# EAGLE schematic artemis_board (EAGLE 9.5.1)

## Sheet 1 of 6
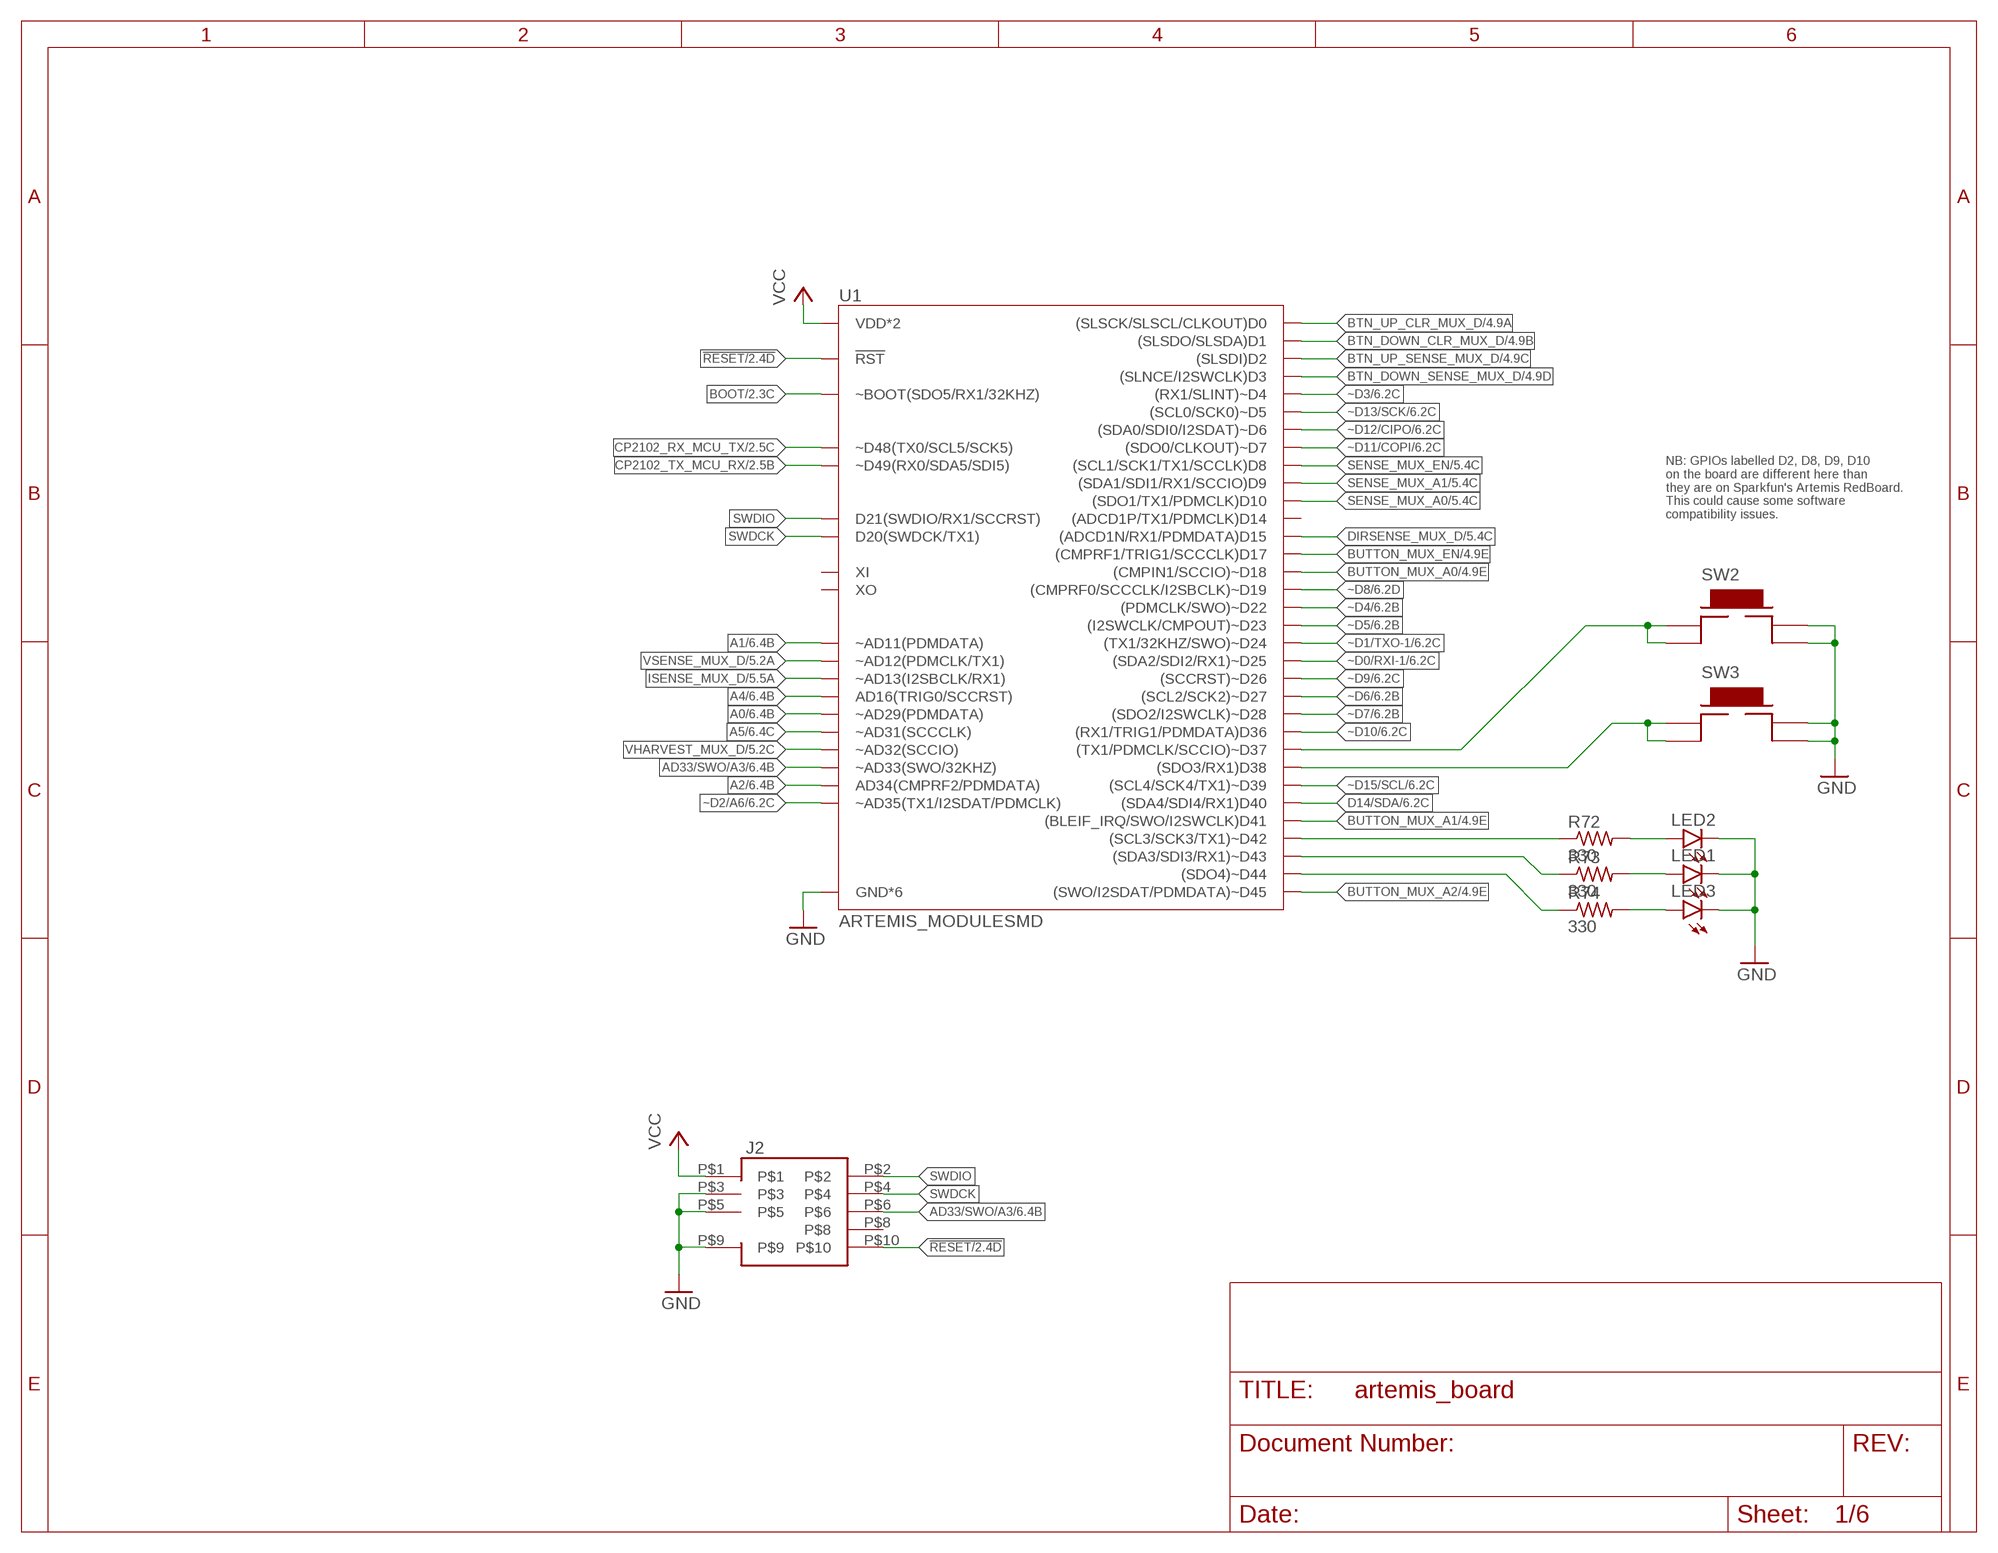
[diagram p0: schematic, sheet 1]

### Parts
J2  FTSH-105-01-F-DV-007-K-P  [FTSH-105-01-F-DV-007-K-P]
LED1  LEDCHIP-LED0603  [CHIP-LED0603]
LED2  LEDCHIP-LED0603  [CHIP-LED0603]
LED3  LEDCHIP-LED0603  [CHIP-LED0603]
R72  330  R-US_R0402  [R0402]
R73  330  R-US_R0402  [R0402]
R74  330  R-US_R0402  [R0402]
SW2  TE_FSM4JSMA  [TE_FSMJSMA]
SW3  TE_FSM4JSMA  [TE_FSMJSMA]
U1  ARTEMIS_MODULESMD  [ARTEMIS_FP]

### Nets
!RESET: J2.P$10 U1.~RST(!RST) ; also sheet 2,6
A0: U1.~AD29(~AD29(PDMDATA)) ; also sheet 6
A1: U1.~AD11(~AD11(PDMDATA)) ; also sheet 6
A2: U1.AD34(AD34(CMPRF2/PDMDATA)) ; also sheet 6
A4: U1.AD16(AD16(TRIG0/SCCRST)) ; also sheet 6
A5: U1.~AD31(~AD31(SCCCLK)) ; also sheet 6
AD33/SWO/A3: J2.P$6 U1.~AD33/SWO(~AD33(SWO/32KHZ)) ; also sheet 6
BOOT: U1.BOOT(~BOOT(SDO5/RX1/32KHZ)) ; also sheet 2
BTN_DOWN_CLR_MUX_D: U1.D1((SLSDO/SLSDA)D1) ; also sheet 4
BTN_DOWN_SENSE_MUX_D: U1.D3((SLNCE/I2SWCLK)D3) ; also sheet 4
BTN_UP_CLR_MUX_D: U1.D0((SLSCK/SLSCL/CLKOUT)D0) ; also sheet 4
BTN_UP_SENSE_MUX_D: U1.D2((SLSDI)D2) ; also sheet 4
BUTTON_MUX_A0: U1.~D18((CMPIN1/SCCIO)~D18) ; also sheet 4
BUTTON_MUX_A1: U1.D41((BLEIF_IRQ/SWO/I2SWCLK)D41) ; also sheet 4
BUTTON_MUX_A2: U1.~D45((SWO/I2SDAT/PDMDATA)~D45) ; also sheet 4
BUTTON_MUX_EN: U1.D17((CMPRF1/TRIG1/SCCCLK)D17) ; also sheet 4
CP2102_RX_MCU_TX: U1.TXO-0(~D48(TX0/SCL5/SCK5)) ; also sheet 2
CP2102_TX_MCU_RX: U1.RXI-0(~D49(RX0/SDA5/SDI5)) ; also sheet 2
D14/SDA: U1.D40((SDA4/SDI4/RX1)D40) ; also sheet 6
DIRSENSE_MUX_D: U1.D15((ADCD1N/RX1/PDMDATA)D15) ; also sheet 5
GND: J2.P$3 J2.P$5 J2.P$9 LED1.C LED2.C LED3.C SW2.P$3 SW2.P$4 SW3.P$3 SW3.P$4 U1.GND@1(GND*6) U1.GND@22(GND*6) U1.GND@38(GND*6) U1.GND@39(GND*6) U1.GND@47(GND*6) U1.GND@59(GND*6) ; also sheet 2,3,4,5,6
ISENSE_MUX_D: U1.~AD13(~AD13(I2SBCLK/RX1)) ; also sheet 5
N$1: R72.1 U1.~D42((SCL3/SCK3/TX1)~D42)
N$5: R73.1 U1.~D43((SDA3/SDI3/RX1)~D43)
N$29: R74.1 U1.~D44((SDO4)~D44)
N$30: LED2.A R72.2
N$31: LED1.A R73.2
N$38: LED3.A R74.2
N$43: SW2.P$1 SW2.P$2 U1.~D37((TX1/PDMCLK/SCCIO)~D37)
N$45: SW3.P$1 SW3.P$2 U1.D38((SDO3/RX1)D38)
SENSE_MUX_A0: U1.D10((SDO1/TX1/PDMCLK)D10) ; also sheet 5
SENSE_MUX_A1: U1.D9((SDA1/SDI1/RX1/SCCIO)D9) ; also sheet 5
SENSE_MUX_EN: U1.D8((SCL1/SCK1/TX1/SCCLK)D8) ; also sheet 5
SWDCK: J2.P$4 U1.SWDCK(D20(SWDCK/TX1))
SWDIO: J2.P$2 U1.SWDIO(D21(SWDIO/RX1/SCCRST))
VCC: J2.P$1 U1.VDD@36(VDD*2) U1.VDD@37(VDD*2) ; also sheet 2,4,5,6
VHARVEST_MUX_D: U1.~AD32(~AD32(SCCIO)) ; also sheet 5
VSENSE_MUX_D: U1.~AD12(~AD12(PDMCLK/TX1)) ; also sheet 5
~D0/RXI-1: U1.~D25((SDA2/SDI2/RX1)~D25) ; also sheet 6
~D1/TXO-1: U1.~D24((TX1/32KHZ/SWO)~D24) ; also sheet 6
~D2/A6: U1.~AD35(~AD35(TX1/I2SDAT/PDMCLK)) ; also sheet 6
~D3: U1.~D4((RX1/SLINT)~D4) ; also sheet 6
~D4: U1.~D22((PDMCLK/SWO)~D22) ; also sheet 6
~D5: U1.~D23((I2SWCLK/CMPOUT)~D23) ; also sheet 6
~D6: U1.~D27((SCL2/SCK2)~D27) ; also sheet 6
~D7: U1.~D28((SDO2/I2SWCLK)~D28) ; also sheet 6
~D8: U1.~D19((CMPRF0/SCCCLK/I2SBCLK)~D19) ; also sheet 6
~D9: U1.~D26((SCCRST)~D26) ; also sheet 6
~D10: U1.D36((RX1/TRIG1/PDMDATA)D36) ; also sheet 6
~D11/COPI: U1.D7((SDO0/CLKOUT)~D7) ; also sheet 6
~D12/CIPO: U1.~D6((SDA0/SDI0/I2SDAT)~D6) ; also sheet 6
~D13/SCK: U1.~D5((SCL0/SCK0)~D5) ; also sheet 6
~D15/SCL: U1.~D39((SCL4/SCK4/TX1)~D39) ; also sheet 6
Unconnected: J2.P$8 U1.D14((ADCD1P/TX1/PDMCLK)D14) U1.XI U1.XO

### Notes on the sheet
- NB: GPIOs labelled D2, D8, D9, D10
  on the board are different here than
  they are on Sparkfun's Artemis RedBoard.
  This could cause some software 
  compatibility issues.

## Sheet 2 of 6
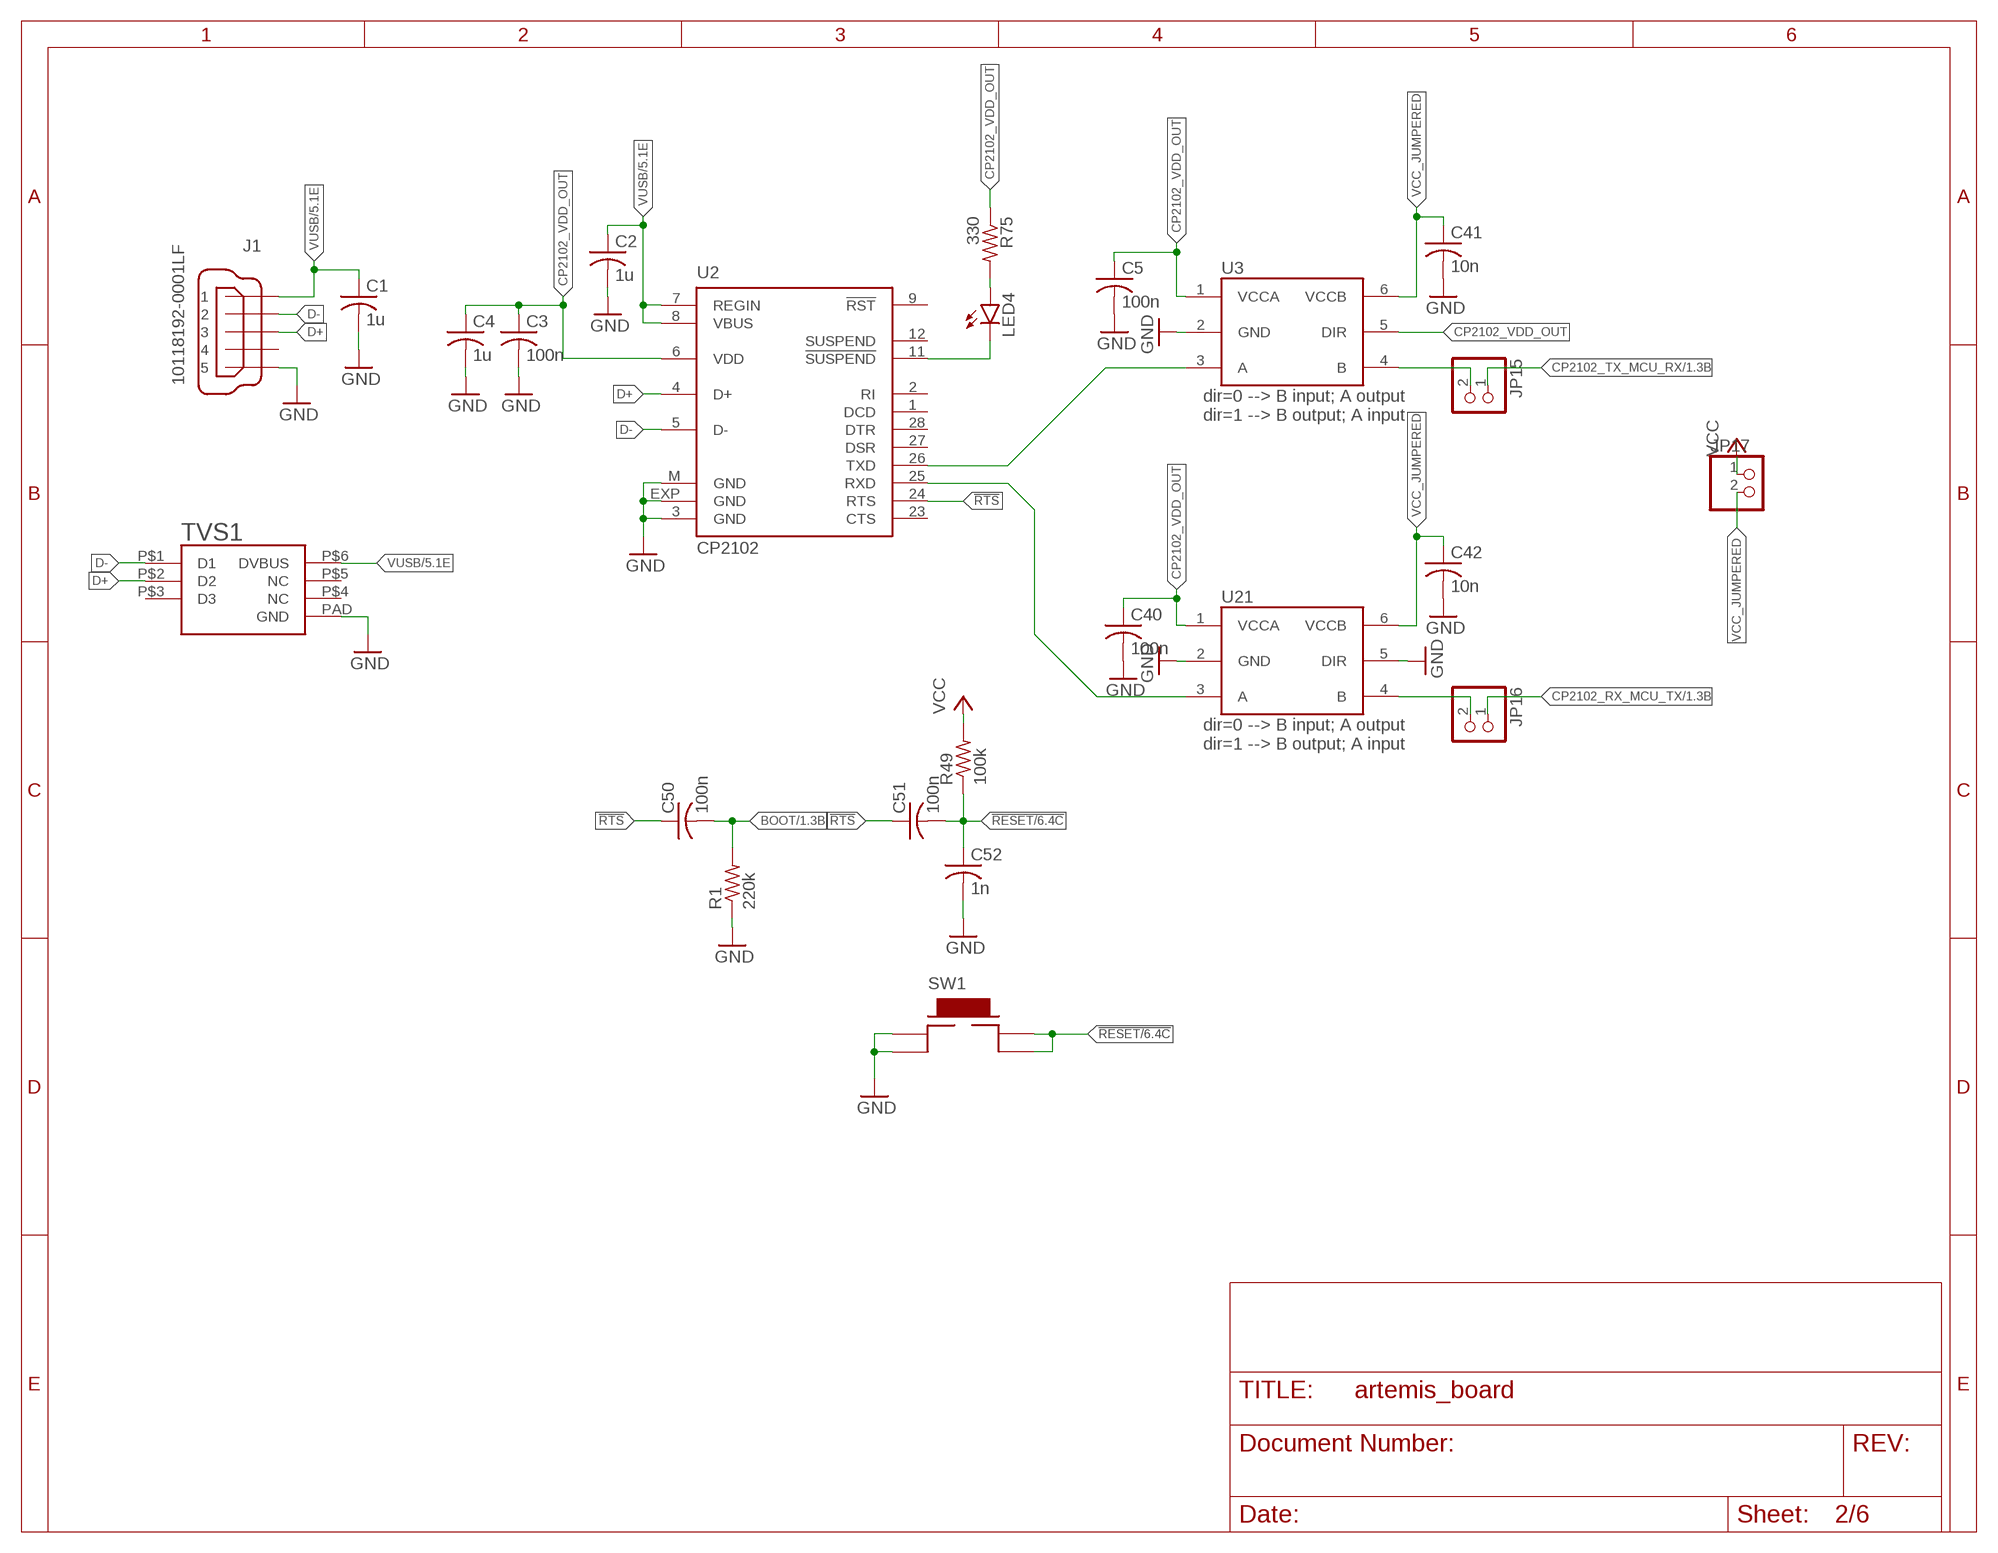
[diagram p1: schematic, sheet 2]

### Parts
C1  1u  C-USC0402  [C0402]
C2  1u  C-USC0402  [C0402]
C3  100n  C-USC0402  [C0402]
C4  1u  C-USC0402  [C0402]
C5  100n  C-USC0402  [C0402]
C40  100n  C-USC0402  [C0402]
C41  10n  C-USC0402  [C0402]
C42  10n  C-USC0402  [C0402]
C50  100n  C-USC0402  [C0402]
C51  100n  C-USC0402  [C0402]
C52  1n  C-USC0402  [C0402]
J1  10118192-0001LF  [10118192-0001LF]
JP15  PINHD-1X2  [1X02]
JP16  PINHD-1X2  [1X02]
JP17  PINHD-1X2  [1X02]
LED4  LEDCHIP-LED0603  [CHIP-LED0603]
R1  220k  R-US_R0402  [R0402]
R49  100k  R-US_R0402  [R0402]
R75  330  R-US_R0402  [R0402]
SW1  TE_FSM4JSMA  [TE_FSMJSMA]
TVS1  RCLAMP3654PAT  [RCLAMP3654PATCT]
U2  CP2102  [MLP28]
U3  74AXP1T45GWH  [SOT65P210X110-6N]
U21  74AXP1T45GWH  [SOT65P210X110-6N]

### Nets
!RESET: C51.2 C52.1 R49.1 SW1.P$3 SW1.P$4 ; also sheet 1,6
!RTS: C50.1 C51.1 U2.24(RTS)
BOOT: C50.2 R1.2 ; also sheet 1
CP2102_RX_MCU_TX: JP16.1 ; also sheet 1
CP2102_TX_MCU_RX: JP15.1 ; also sheet 1
CP2102_VDD_OUT: C3.1 C4.1 C5.1 C40.1 R75.1 U2.6(VDD) U3.1(VCCA) U3.5(DIR) U21.1(VCCA)
D+: J1.3 TVS1.P$2(D2) U2.4(D+)
D-: J1.2 TVS1.P$1(D1) U2.5(D-)
GND: C1.2 C2.2 C3.2 C4.2 C5.2 C40.2 C41.2 C42.2 C52.2 J1.5 R1.1 SW1.P$1 SW1.P$2 TVS1.PAD(GND) U2.3(GND) U2.EXP(GND) U2.M(GND) U3.2(GND) U21.2(GND) U21.5(DIR) ; also sheet 1,3,4,5,6
N$3: LED4.A R75.2
N$26: JP15.2 U3.4(B)
N$27: JP16.2 U21.4(B)
N$28: LED4.C U2.11(!SUSPEND)
RXD_3V3: U2.25(RXD) U21.3(A)
TXD_3V3: U2.26(TXD) U3.3(A)
VCC: JP17.1 R49.2 ; also sheet 1,4,5,6
VCC_JUMPERED: C41.1 C42.1 JP17.2 U3.6(VCCB) U21.6(VCCB)
VUSB: C1.1 C2.1 J1.1 TVS1.P$6(DVBUS) U2.7(REGIN) U2.8(VBUS) ; also sheet 5
Unconnected: J1.4 TVS1.P$3(D3) TVS1.P$4(NC) TVS1.P$5(NC) U2.1(DCD) U2.2(RI) U2.9(!RST) U2.12(SUSPEND) U2.23(CTS) U2.27(DSR) U2.28(DTR)

## Sheet 3 of 6
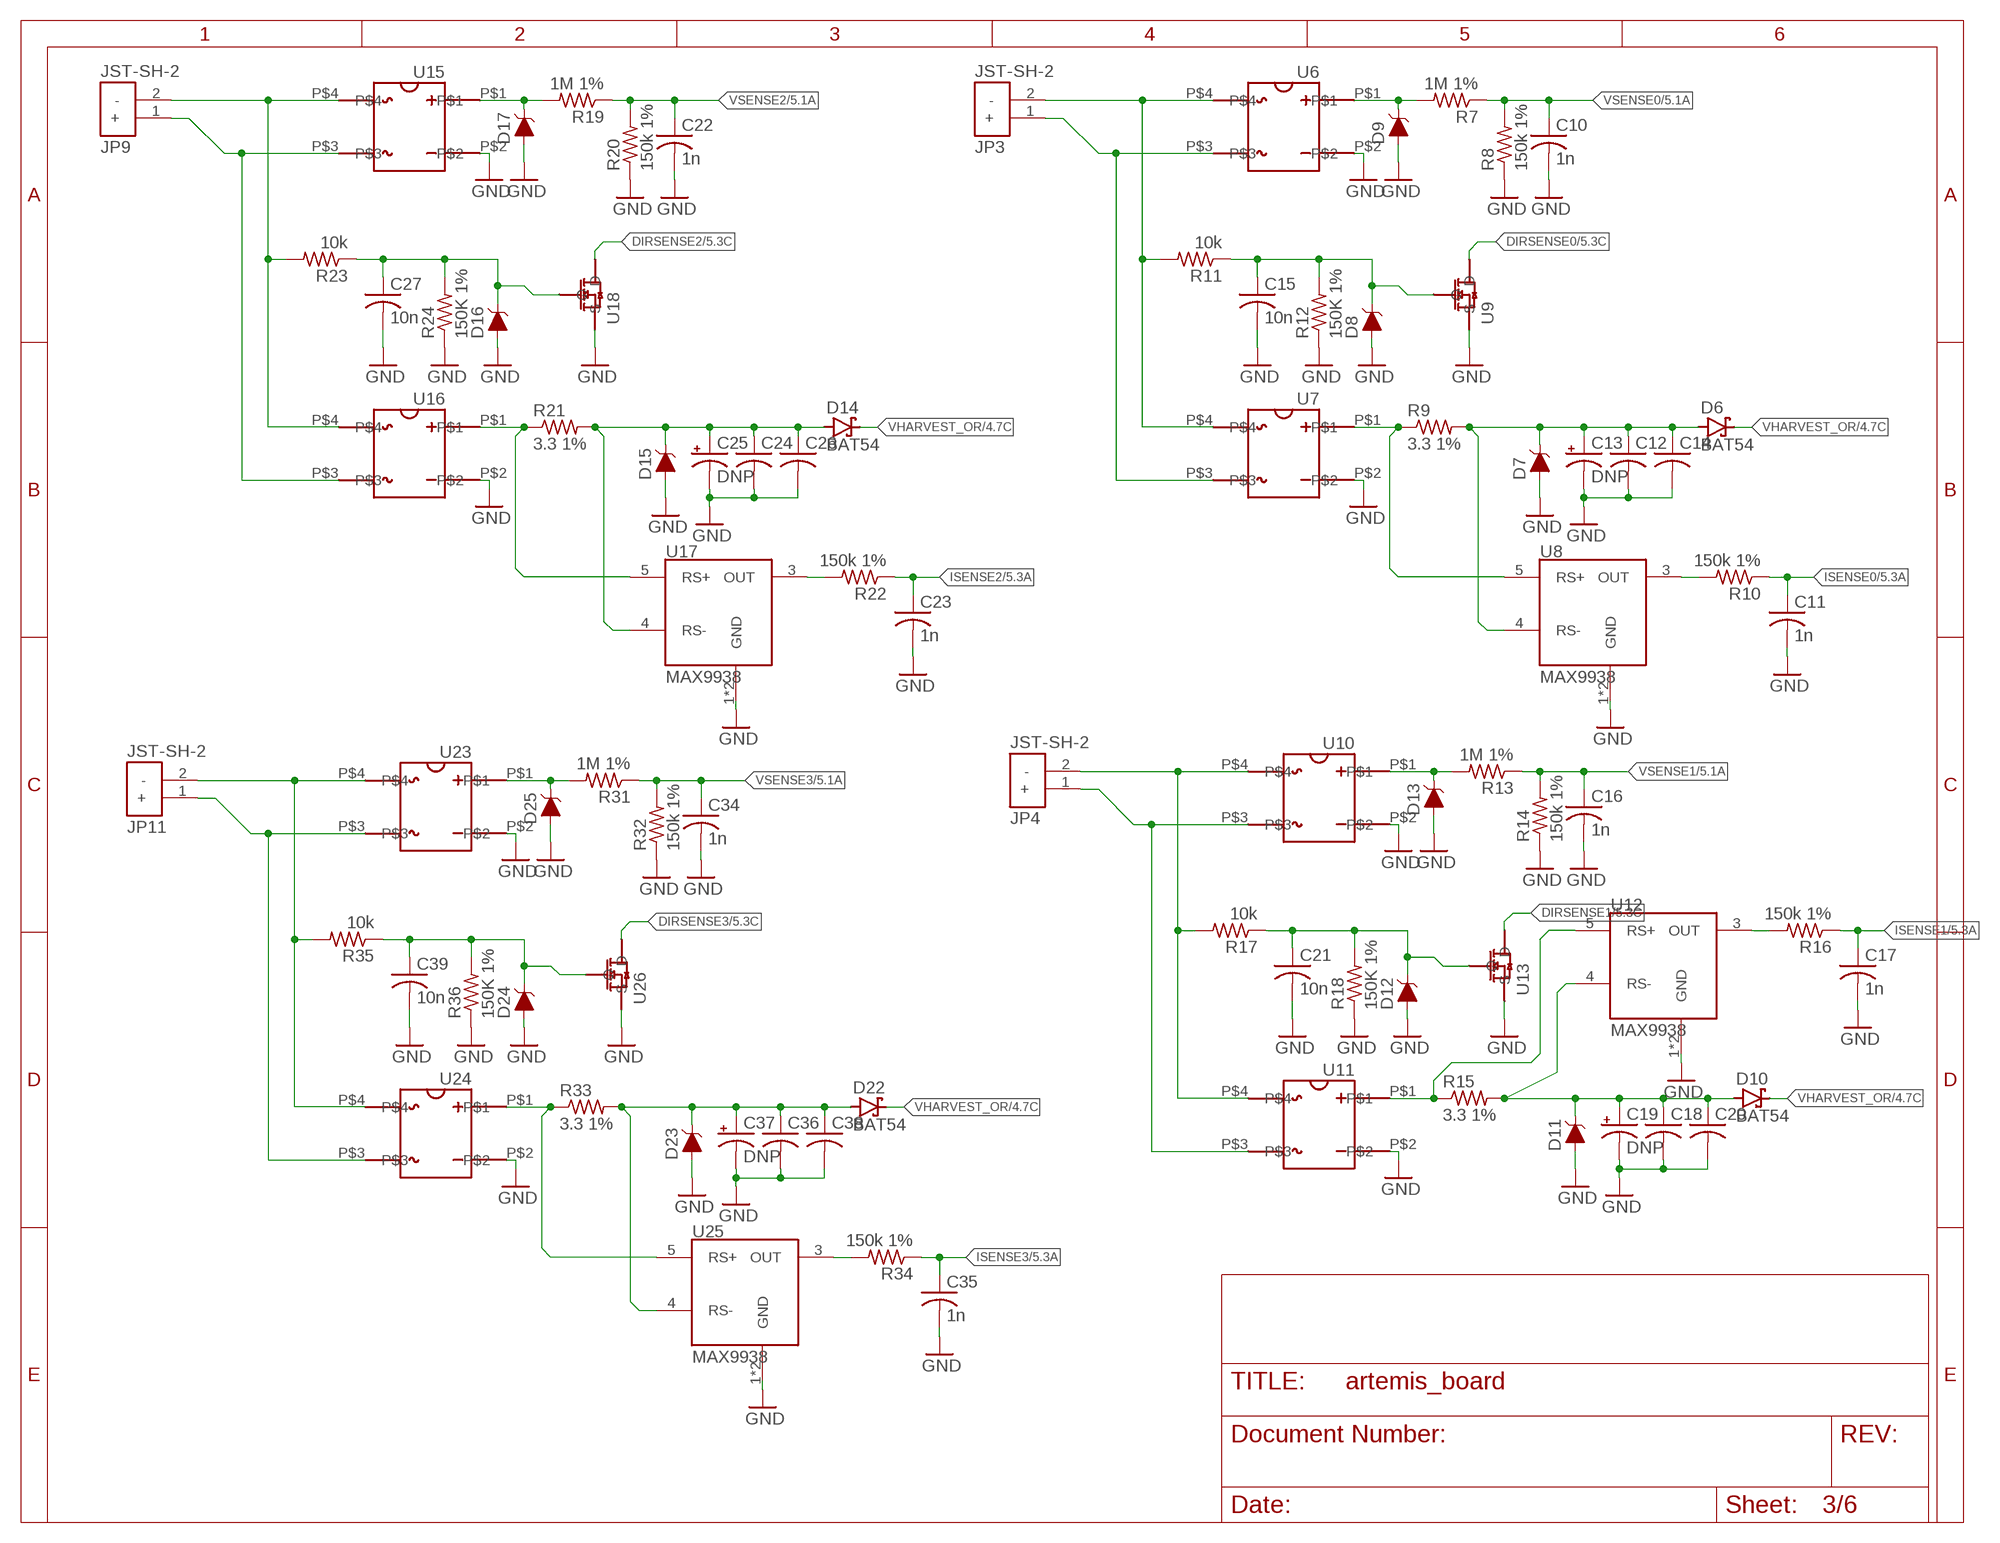
[diagram p2: schematic, sheet 3]

### Parts
C10  1n  C-USC0402  [C0402]
C11  1n  C-USC0402  [C0402]
C12  C-USC1206  [C1206]
C13  DNP  CPOL-USE2.5-5  [E2,5-5]
C14  C-USC1206  [C1206]
C15  10n  C-USC0402  [C0402]
C16  1n  C-USC0402  [C0402]
C17  1n  C-USC0402  [C0402]
C18  C-USC1206  [C1206]
C19  DNP  CPOL-USE2.5-5  [E2,5-5]
C20  C-USC1206  [C1206]
C21  10n  C-USC0402  [C0402]
C22  1n  C-USC0402  [C0402]
C23  1n  C-USC0402  [C0402]
C24  C-USC1206  [C1206]
C25  DNP  CPOL-USE2.5-5  [E2,5-5]
C26  C-USC1206  [C1206]
C27  10n  C-USC0402  [C0402]
C34  1n  C-USC0402  [C0402]
C35  1n  C-USC0402  [C0402]
C36  C-USC1206  [C1206]
C37  DNP  CPOL-USE2.5-5  [E2,5-5]
C38  C-USC1206  [C1206]
C39  10n  C-USC0402  [C0402]
D6  BAT54  [SOT23]
D7  3.3V  DIODE-ZENER-MM3Z3V3T1G  [SOD-323]
D8  3.3V  DIODE-ZENER-MM3Z3V3T1G  [SOD-323]
D9  3.3V  DIODE-ZENER-MM3Z3V3T1G  [SOD-323]
D10  BAT54  [SOT23]
D11  3.3V  DIODE-ZENER-MM3Z3V3T1G  [SOD-323]
D12  3.3V  DIODE-ZENER-MM3Z3V3T1G  [SOD-323]
D13  3.3V  DIODE-ZENER-MM3Z3V3T1G  [SOD-323]
D14  BAT54  [SOT23]
D15  3.3V  DIODE-ZENER-MM3Z3V3T1G  [SOD-323]
D16  3.3V  DIODE-ZENER-MM3Z3V3T1G  [SOD-323]
D17  3.3V  DIODE-ZENER-MM3Z3V3T1G  [SOD-323]
D22  BAT54  [SOT23]
D23  3.3V  DIODE-ZENER-MM3Z3V3T1G  [SOD-323]
D24  3.3V  DIODE-ZENER-MM3Z3V3T1G  [SOD-323]
D25  3.3V  DIODE-ZENER-MM3Z3V3T1G  [SOD-323]
JP3  JST-SH-2  [JST-SH-2]
JP4  JST-SH-2  [JST-SH-2]
JP9  JST-SH-2  [JST-SH-2]
JP11  JST-SH-2  [JST-SH-2]
R7  1M 1%  R-US_R0402  [R0402]
R8  150k 1%  R-US_R0402  [R0402]
R9  3.3 1%  R-US_R0603  [R0603]
R10  150k 1%  R-US_R0402  [R0402]
R11  10k  R-US_R0402  [R0402]
R12  150K 1%  R-US_R0402  [R0402]
R13  1M 1%  R-US_R0402  [R0402]
R14  150k 1%  R-US_R0402  [R0402]
R15  3.3 1%  R-US_R0603  [R0603]
R16  150k 1%  R-US_R0402  [R0402]
R17  10k  R-US_R0402  [R0402]
R18  150K 1%  R-US_R0402  [R0402]
R19  1M 1%  R-US_R0402  [R0402]
R20  150k 1%  R-US_R0402  [R0402]
R21  3.3 1%  R-US_R0603  [R0603]
R22  150k 1%  R-US_R0402  [R0402]
R23  10k  R-US_R0402  [R0402]
R24  150K 1%  R-US_R0402  [R0402]
R31  1M 1%  R-US_R0402  [R0402]
R32  150k 1%  R-US_R0402  [R0402]
R33  3.3 1%  R-US_R0603  [R0603]
R34  150k 1%  R-US_R0402  [R0402]
R35  10k  R-US_R0402  [R0402]
R36  150K 1%  R-US_R0402  [R0402]
U6  CDBHD140L-G  [CDBHDXX0L-G]
U7  CDBHD140L-G  [CDBHDXX0L-G]
U8  MAX9938  [SOT23-5]
U9  TN2106K1-G  [TN2106K1-G]
U10  CDBHD140L-G  [CDBHDXX0L-G]
U11  CDBHD140L-G  [CDBHDXX0L-G]
U12  MAX9938  [SOT23-5]
U13  TN2106K1-G  [TN2106K1-G]
U15  CDBHD140L-G  [CDBHDXX0L-G]
U16  CDBHD140L-G  [CDBHDXX0L-G]
U17  MAX9938  [SOT23-5]
U18  TN2106K1-G  [TN2106K1-G]
U23  CDBHD140L-G  [CDBHDXX0L-G]
U24  CDBHD140L-G  [CDBHDXX0L-G]
U25  MAX9938  [SOT23-5]
U26  TN2106K1-G  [TN2106K1-G]

### Nets
DIRSENSE0: U9.D ; also sheet 5
DIRSENSE1: U13.D ; also sheet 5
DIRSENSE2: U18.D ; also sheet 5
DIRSENSE3: U26.D ; also sheet 5
GND: C10.2 C11.2 C12.2 C13.- C14.2 C15.2 C16.2 C17.2 C18.2 C19.- C20.2 C21.2 C22.2 C23.2 C24.2 C25.- C26.2 C27.2 C34.2 C35.2 C36.2 C37.- C38.2 C39.2 D7.A D8.A D9.A D11.A D12.A D13.A D15.A D16.A D17.A D23.A D24.A D25.A R8.1 R12.1 R14.1 R18.1 R20.1 R24.1 R32.1 R36.1 U6.P$2 U7.P$2 U8.1(GND) U8.2(GND) U9.S U10.P$2 U11.P$2 U12.1(GND) U12.2(GND) U13.S U15.P$2 U16.P$2 U17.1(GND) U17.2(GND) U18.S U23.P$2 U24.P$2 U25.1(GND) U25.2(GND) U26.S ; also sheet 1,2,4,5,6
ISENSE0: C11.1 R10.1 ; also sheet 5
ISENSE1: C17.1 R16.1 ; also sheet 5
ISENSE2: C23.1 R22.1 ; also sheet 5
ISENSE3: C35.1 R34.1 ; also sheet 5
N$8: JP3.2(-) R11.2 U6.P$4 U7.P$4
N$9: JP3.1(+) U6.P$3 U7.P$3
N$10: D9.C R7.2 U6.P$1
N$11: R9.1 U7.P$1 U8.5(RS+)
N$12: R10.2 U8.3(OUT)
N$13: C15.1 D8.C R11.1 R12.2 U9.G
N$14: JP4.2(-) R17.2 U10.P$4 U11.P$4
N$15: JP4.1(+) U10.P$3 U11.P$3
N$16: D13.C R13.2 U10.P$1
N$17: R15.1 U11.P$1 U12.5(RS+)
N$18: R16.2 U12.3(OUT)
N$19: C21.1 D12.C R17.1 R18.2 U13.G
N$20: JP9.2(-) R23.2 U15.P$4 U16.P$4
N$21: JP9.1(+) U15.P$3 U16.P$3
N$22: D17.C R19.2 U15.P$1
N$23: R21.1 U16.P$1 U17.5(RS+)
N$24: R22.2 U17.3(OUT)
N$25: C27.1 D16.C R23.1 R24.2 U18.G
N$32: JP11.2(-) R35.2 U23.P$4 U24.P$4
N$33: JP11.1(+) U23.P$3 U24.P$3
N$34: D25.C R31.2 U23.P$1
N$35: R33.1 U24.P$1 U25.5(RS+)
N$36: R34.2 U25.3(OUT)
N$37: C39.1 D24.C R35.1 R36.2 U26.G
VHARVEST0: C12.1 C13.+ C14.1 D6.1(A) D7.C R9.2 U8.4(RS-) ; also sheet 5
VHARVEST1: C18.1 C19.+ C20.1 D10.1(A) D11.C R15.2 U12.4(RS-) ; also sheet 5
VHARVEST2: C24.1 C25.+ C26.1 D14.1(A) D15.C R21.2 U17.4(RS-) ; also sheet 5
VHARVEST3: C36.1 C37.+ C38.1 D22.1(A) D23.C R33.2 U25.4(RS-) ; also sheet 5
VHARVEST_OR: D6.3(C) D10.3(C) D14.3(C) D22.3(C) ; also sheet 4,5,6
VSENSE0: C10.1 R7.1 R8.2 ; also sheet 5
VSENSE1: C16.1 R13.1 R14.2 ; also sheet 5
VSENSE2: C22.1 R19.1 R20.2 ; also sheet 5
VSENSE3: C34.1 R31.1 R32.2 ; also sheet 5

## Sheet 4 of 6
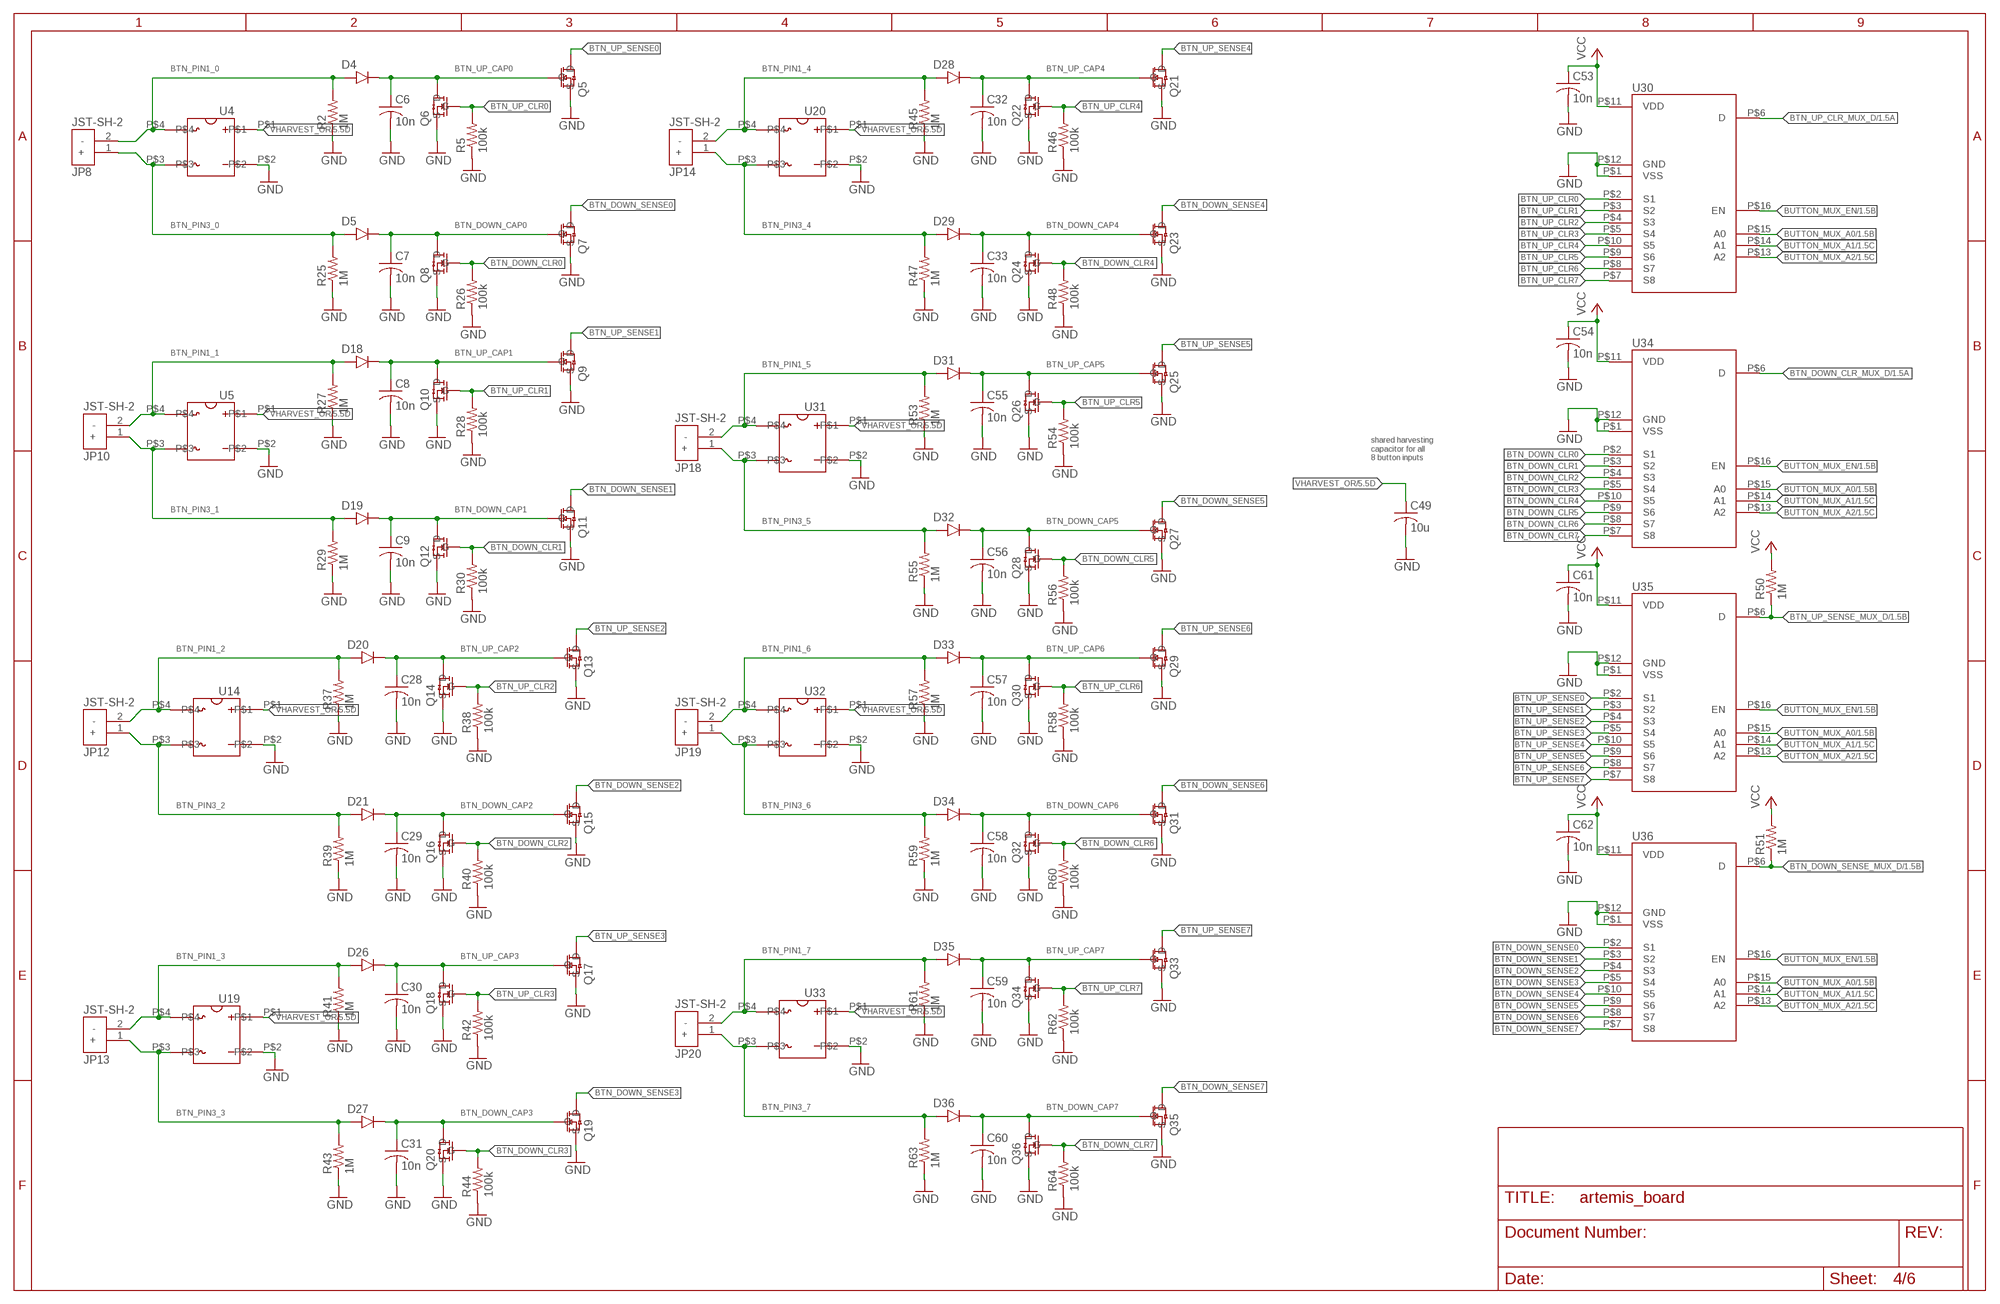
[diagram p3: schematic, sheet 4]

### Parts
C6  10n  C-USC0402  [C0402]
C7  10n  C-USC0402  [C0402]
C8  10n  C-USC0402  [C0402]
C9  10n  C-USC0402  [C0402]
C28  10n  C-USC0402  [C0402]
C29  10n  C-USC0402  [C0402]
C30  10n  C-USC0402  [C0402]
C31  10n  C-USC0402  [C0402]
C32  10n  C-USC0402  [C0402]
C33  10n  C-USC0402  [C0402]
C49  10u  C-USC0603  [C0603]
C53  10n  C-USC0402  [C0402]
C54  10n  C-USC0402  [C0402]
C55  10n  C-USC0402  [C0402]
C56  10n  C-USC0402  [C0402]
C57  10n  C-USC0402  [C0402]
C58  10n  C-USC0402  [C0402]
C59  10n  C-USC0402  [C0402]
C60  10n  C-USC0402  [C0402]
C61  10n  C-USC0402  [C0402]
C62  10n  C-USC0402  [C0402]
D4  DFLU1200  [DFLU1200]
D5  DFLU1200  [DFLU1200]
D18  DFLU1200  [DFLU1200]
D19  DFLU1200  [DFLU1200]
D20  DFLU1200  [DFLU1200]
D21  DFLU1200  [DFLU1200]
D26  DFLU1200  [DFLU1200]
D27  DFLU1200  [DFLU1200]
D28  DFLU1200  [DFLU1200]
D29  DFLU1200  [DFLU1200]
D31  DFLU1200  [DFLU1200]
D32  DFLU1200  [DFLU1200]
D33  DFLU1200  [DFLU1200]
D34  DFLU1200  [DFLU1200]
D35  DFLU1200  [DFLU1200]
D36  DFLU1200  [DFLU1200]
JP8  JST-SH-2  [JST-SH-2]
JP10  JST-SH-2  [JST-SH-2]
JP12  JST-SH-2  [JST-SH-2]
JP13  JST-SH-2  [JST-SH-2]
JP14  JST-SH-2  [JST-SH-2]
JP18  JST-SH-2  [JST-SH-2]
JP19  JST-SH-2  [JST-SH-2]
JP20  JST-SH-2  [JST-SH-2]
Q5  2N7002K-7  [2N7002K-7]
Q6  BSS138K  [BSS138K]
Q7  2N7002K-7  [2N7002K-7]
Q8  BSS138K  [BSS138K]
Q9  2N7002K-7  [2N7002K-7]
Q10  BSS138K  [BSS138K]
Q11  2N7002K-7  [2N7002K-7]
Q12  BSS138K  [BSS138K]
Q13  2N7002K-7  [2N7002K-7]
Q14  BSS138K  [BSS138K]
Q15  2N7002K-7  [2N7002K-7]
Q16  BSS138K  [BSS138K]
Q17  2N7002K-7  [2N7002K-7]
Q18  BSS138K  [BSS138K]
Q19  2N7002K-7  [2N7002K-7]
Q20  BSS138K  [BSS138K]
Q21  2N7002K-7  [2N7002K-7]
Q22  BSS138K  [BSS138K]
Q23  2N7002K-7  [2N7002K-7]
Q24  BSS138K  [BSS138K]
Q25  2N7002K-7  [2N7002K-7]
Q26  BSS138K  [BSS138K]
Q27  2N7002K-7  [2N7002K-7]
Q28  BSS138K  [BSS138K]
Q29  2N7002K-7  [2N7002K-7]
Q30  BSS138K  [BSS138K]
Q31  2N7002K-7  [2N7002K-7]
Q32  BSS138K  [BSS138K]
Q33  2N7002K-7  [2N7002K-7]
Q34  BSS138K  [BSS138K]
Q35  2N7002K-7  [2N7002K-7]
Q36  BSS138K  [BSS138K]
R2  1M  R-US_R0402  [R0402]
R5  100k  R-US_R0402  [R0402]
R25  1M  R-US_R0402  [R0402]
R26  100k  R-US_R0402  [R0402]
R27  1M  R-US_R0402  [R0402]
R28  100k  R-US_R0402  [R0402]
R29  1M  R-US_R0402  [R0402]
R30  100k  R-US_R0402  [R0402]
R37  1M  R-US_R0402  [R0402]
R38  100k  R-US_R0402  [R0402]
R39  1M  R-US_R0402  [R0402]
R40  100k  R-US_R0402  [R0402]
R41  1M  R-US_R0402  [R0402]
R42  100k  R-US_R0402  [R0402]
R43  1M  R-US_R0402  [R0402]
R44  100k  R-US_R0402  [R0402]
R45  1M  R-US_R0402  [R0402]
R46  100k  R-US_R0402  [R0402]
R47  1M  R-US_R0402  [R0402]
R48  100k  R-US_R0402  [R0402]
R50  1M  R-US_R0402  [R0402]
R51  1M  R-US_R0402  [R0402]
R53  1M  R-US_R0402  [R0402]
R54  100k  R-US_R0402  [R0402]
R55  1M  R-US_R0402  [R0402]
R56  100k  R-US_R0402  [R0402]
R57  1M  R-US_R0402  [R0402]
R58  100k  R-US_R0402  [R0402]
R59  1M  R-US_R0402  [R0402]
R60  100k  R-US_R0402  [R0402]
R61  1M  R-US_R0402  [R0402]
R62  100k  R-US_R0402  [R0402]
R63  1M  R-US_R0402  [R0402]
R64  100k  R-US_R0402  [R0402]
U4  CDBHD140L-G  [CDBHDXX0L-G]
U5  CDBHD140L-G  [CDBHDXX0L-G]
U14  CDBHD140L-G  [CDBHDXX0L-G]
U19  CDBHD140L-G  [CDBHDXX0L-G]
U20  CDBHD140L-G  [CDBHDXX0L-G]
U30  TMUX1108RSVR  [UQFN16-RSV0016A]
U31  CDBHD140L-G  [CDBHDXX0L-G]
U32  CDBHD140L-G  [CDBHDXX0L-G]
U33  CDBHD140L-G  [CDBHDXX0L-G]
U34  TMUX1108RSVR  [UQFN16-RSV0016A]
U35  TMUX1108RSVR  [UQFN16-RSV0016A]
U36  TMUX1108RSVR  [UQFN16-RSV0016A]

### Nets
BTN_DOWN_CAP0: C7.1 D5.K Q7.G Q8.D
BTN_DOWN_CAP1: C9.1 D19.K Q11.G Q12.D
BTN_DOWN_CAP2: C29.1 D21.K Q15.G Q16.D
BTN_DOWN_CAP3: C31.1 D27.K Q19.G Q20.D
BTN_DOWN_CAP4: C33.1 D29.K Q23.G Q24.D
BTN_DOWN_CAP5: C56.1 D32.K Q27.G Q28.D
BTN_DOWN_CAP6: C58.1 D34.K Q31.G Q32.D
BTN_DOWN_CAP7: C60.1 D36.K Q35.G Q36.D
BTN_DOWN_CLR0: Q8.G R26.2 U34.P$2(S1)
BTN_DOWN_CLR1: Q12.G R30.2 U34.P$3(S2)
BTN_DOWN_CLR2: Q16.G R40.2 U34.P$4(S3)
BTN_DOWN_CLR3: Q20.G R44.2 U34.P$5(S4)
BTN_DOWN_CLR4: Q24.G R48.2 U34.P$10(S5)
BTN_DOWN_CLR5: Q28.G R56.2 U34.P$9(S6)
BTN_DOWN_CLR6: Q32.G R60.2 U34.P$8(S7)
BTN_DOWN_CLR7: Q36.G R64.2 U34.P$7(S8)
BTN_DOWN_CLR_MUX_D: U34.P$6(D) ; also sheet 1
BTN_DOWN_SENSE0: Q7.D U36.P$2(S1)
BTN_DOWN_SENSE1: Q11.D U36.P$3(S2)
BTN_DOWN_SENSE2: Q15.D U36.P$4(S3)
BTN_DOWN_SENSE3: Q19.D U36.P$5(S4)
BTN_DOWN_SENSE4: Q23.D U36.P$10(S5)
BTN_DOWN_SENSE5: Q27.D U36.P$9(S6)
BTN_DOWN_SENSE6: Q31.D U36.P$8(S7)
BTN_DOWN_SENSE7: Q35.D U36.P$7(S8)
BTN_DOWN_SENSE_MUX_D: R51.1 U36.P$6(D) ; also sheet 1
BTN_PIN1_0: D4.A JP8.2(-) R2.2 U4.P$4
BTN_PIN1_1: D18.A JP10.2(-) R27.2 U5.P$4
BTN_PIN1_2: D20.A JP12.2(-) R37.2 U14.P$4
BTN_PIN1_3: D26.A JP13.2(-) R41.2 U19.P$4
BTN_PIN1_4: D28.A JP14.2(-) R45.2 U20.P$4
BTN_PIN1_5: D31.A JP18.2(-) R53.2 U31.P$4
BTN_PIN1_6: D33.A JP19.2(-) R57.2 U32.P$4
BTN_PIN1_7: D35.A JP20.2(-) R61.2 U33.P$4
BTN_PIN3_0: D5.A JP8.1(+) R25.2 U4.P$3
BTN_PIN3_1: D19.A JP10.1(+) R29.2 U5.P$3
BTN_PIN3_2: D21.A JP12.1(+) R39.2 U14.P$3
BTN_PIN3_3: D27.A JP13.1(+) R43.2 U19.P$3
BTN_PIN3_4: D29.A JP14.1(+) R47.2 U20.P$3
BTN_PIN3_5: D32.A JP18.1(+) R55.2 U31.P$3
BTN_PIN3_6: D34.A JP19.1(+) R59.2 U32.P$3
BTN_PIN3_7: D36.A JP20.1(+) R63.2 U33.P$3
BTN_UP_CAP0: C6.1 D4.K Q5.G Q6.D
BTN_UP_CAP1: C8.1 D18.K Q9.G Q10.D
BTN_UP_CAP2: C28.1 D20.K Q13.G Q14.D
BTN_UP_CAP3: C30.1 D26.K Q17.G Q18.D
BTN_UP_CAP4: C32.1 D28.K Q21.G Q22.D
BTN_UP_CAP5: C55.1 D31.K Q25.G Q26.D
BTN_UP_CAP6: C57.1 D33.K Q29.G Q30.D
BTN_UP_CAP7: C59.1 D35.K Q33.G Q34.D
BTN_UP_CLR0: Q6.G R5.2 U30.P$2(S1)
BTN_UP_CLR1: Q10.G R28.2 U30.P$3(S2)
BTN_UP_CLR2: Q14.G R38.2 U30.P$4(S3)
BTN_UP_CLR3: Q18.G R42.2 U30.P$5(S4)
BTN_UP_CLR4: Q22.G R46.2 U30.P$10(S5)
BTN_UP_CLR5: Q26.G R54.2 U30.P$9(S6)
BTN_UP_CLR6: Q30.G R58.2 U30.P$8(S7)
BTN_UP_CLR7: Q34.G R62.2 U30.P$7(S8)
BTN_UP_CLR_MUX_D: U30.P$6(D) ; also sheet 1
BTN_UP_SENSE0: Q5.D U35.P$2(S1)
BTN_UP_SENSE1: Q9.D U35.P$3(S2)
BTN_UP_SENSE2: Q13.D U35.P$4(S3)
BTN_UP_SENSE3: Q17.D U35.P$5(S4)
BTN_UP_SENSE4: Q21.D U35.P$10(S5)
BTN_UP_SENSE5: Q25.D U35.P$9(S6)
BTN_UP_SENSE6: Q29.D U35.P$8(S7)
BTN_UP_SENSE7: Q33.D U35.P$7(S8)
BTN_UP_SENSE_MUX_D: R50.1 U35.P$6(D) ; also sheet 1
BUTTON_MUX_A0: U30.P$15(A0) U34.P$15(A0) U35.P$15(A0) U36.P$15(A0) ; also sheet 1
BUTTON_MUX_A1: U30.P$14(A1) U34.P$14(A1) U35.P$14(A1) U36.P$14(A1) ; also sheet 1
BUTTON_MUX_A2: U30.P$13(A2) U34.P$13(A2) U35.P$13(A2) U36.P$13(A2) ; also sheet 1
BUTTON_MUX_EN: U30.P$16(EN) U34.P$16(EN) U35.P$16(EN) U36.P$16(EN) ; also sheet 1
GND: C6.2 C7.2 C8.2 C9.2 C28.2 C29.2 C30.2 C31.2 C32.2 C33.2 C49.2 C53.2 C54.2 C55.2 C56.2 C57.2 C58.2 C59.2 C60.2 C61.2 C62.2 Q5.S Q6.S Q7.S Q8.S Q9.S Q10.S Q11.S Q12.S Q13.S Q14.S Q15.S Q16.S Q17.S Q18.S Q19.S Q20.S Q21.S Q22.S Q23.S Q24.S Q25.S Q26.S Q27.S Q28.S Q29.S Q30.S Q31.S Q32.S Q33.S Q34.S Q35.S Q36.S R2.1 R5.1 R25.1 R26.1 R27.1 R28.1 R29.1 R30.1 R37.1 R38.1 R39.1 R40.1 R41.1 R42.1 R43.1 R44.1 R45.1 R46.1 R47.1 R48.1 R53.1 R54.1 R55.1 R56.1 R57.1 R58.1 R59.1 R60.1 R61.1 R62.1 R63.1 R64.1 U4.P$2 U5.P$2 U14.P$2 U19.P$2 U20.P$2 U30.P$1(VSS) U30.P$12(GND) U31.P$2 U32.P$2 U33.P$2 U34.P$1(VSS) U34.P$12(GND) U35.P$1(VSS) U35.P$12(GND) U36.P$1(VSS) U36.P$12(GND) ; also sheet 1,2,3,5,6
VCC: C53.1 C54.1 C61.1 C62.1 R50.2 R51.2 U30.P$11(VDD) U34.P$11(VDD) U35.P$11(VDD) U36.P$11(VDD) ; also sheet 1,2,5,6
VHARVEST_OR: C49.1 U4.P$1 U5.P$1 U14.P$1 U19.P$1 U20.P$1 U31.P$1 U32.P$1 U33.P$1 ; also sheet 3,5,6

### Notes on the sheet
- shared harvesting
  capacitor for all
  8 button inputs

## Sheet 5 of 6
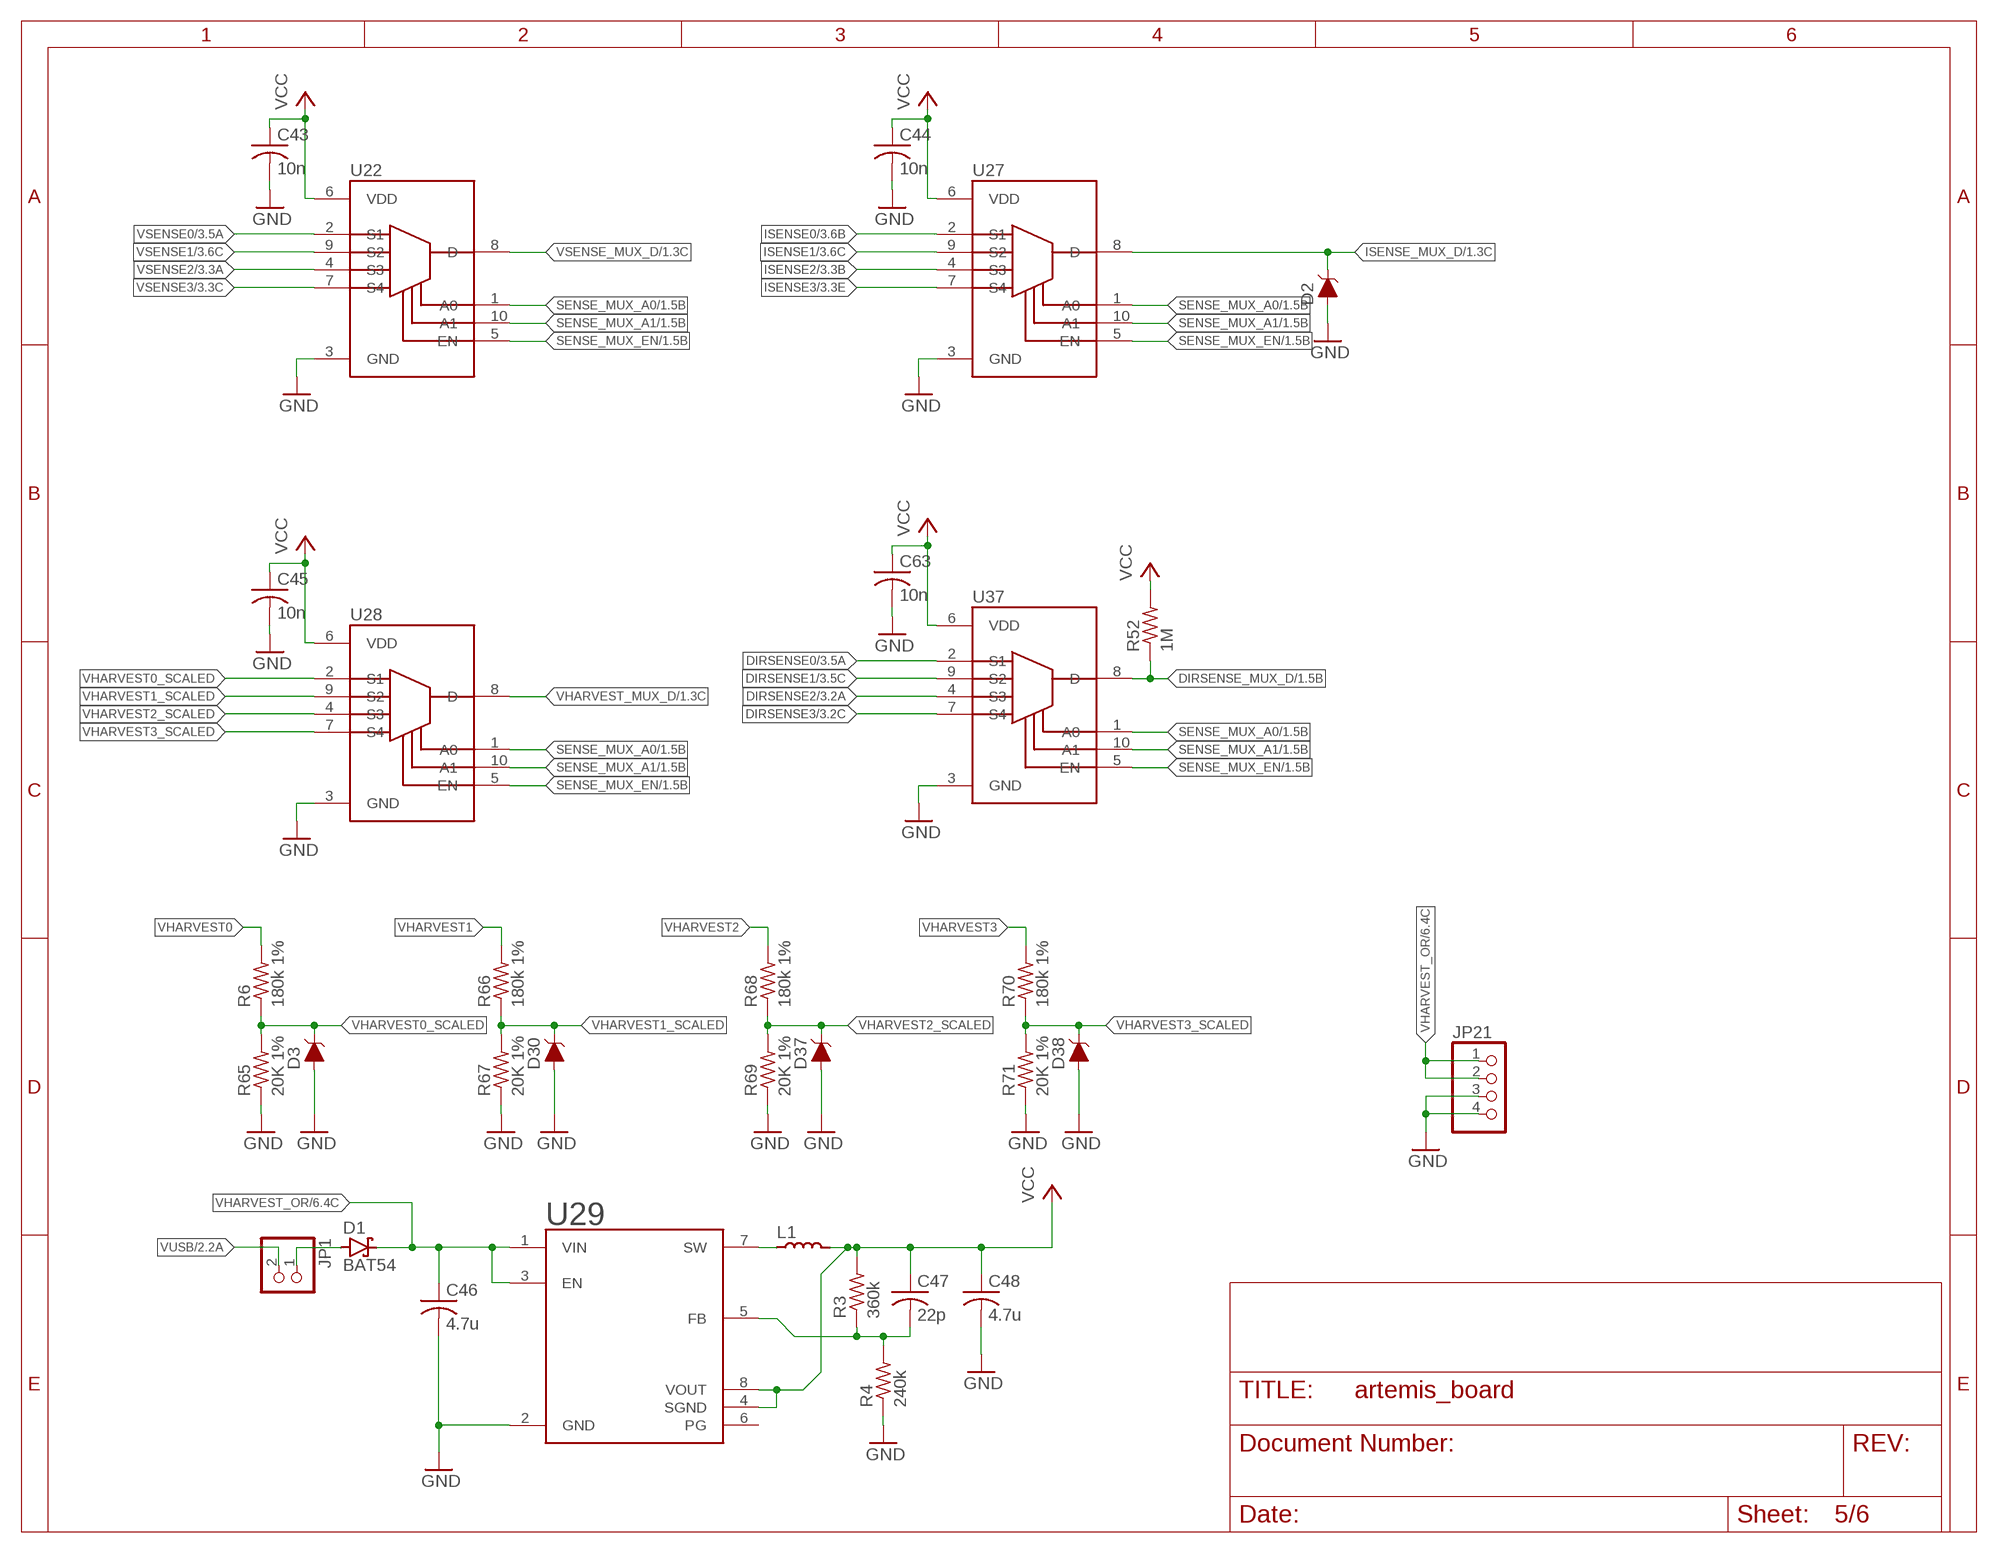
[diagram p4: schematic, sheet 5]

### Parts
C43  10n  C-USC0402  [C0402]
C44  10n  C-USC0402  [C0402]
C45  10n  C-USC0402  [C0402]
C46  4.7u  C-USC0603  [C0603]
C47  22p  C-USC0402  [C0402]
C48  4.7u  C-USC0603  [C0603]
C63  10n  C-USC0402  [C0402]
D1  BAT54  [SOT23]
D2  3.3V  DIODE-ZENER-MM3Z3V3T1G  [SOD-323]
D3  3.3V  DIODE-ZENER-MM3Z3V3T1G  [SOD-323]
D30  3.3V  DIODE-ZENER-MM3Z3V3T1G  [SOD-323]
D37  3.3V  DIODE-ZENER-MM3Z3V3T1G  [SOD-323]
D38  3.3V  DIODE-ZENER-MM3Z3V3T1G  [SOD-323]
JP1  PINHD-1X2  [1X02]
JP21  PINHD-1X4  [1X04]
L1  22u  LQH3NPN220MMEL  [LQH3NPNXXXXMEX]
R3  360k  R-US_R0603  [R0603]
R4  240k  R-US_R0603  [R0603]
R6  180k 1%  R-US_R0402  [R0402]
R52  1M  R-US_R0402  [R0402]
R65  20K 1%  R-US_R0402  [R0402]
R66  180k 1%  R-US_R0402  [R0402]
R67  20K 1%  R-US_R0402  [R0402]
R68  180k 1%  R-US_R0402  [R0402]
R69  20K 1%  R-US_R0402  [R0402]
R70  180k 1%  R-US_R0402  [R0402]
R71  20K 1%  R-US_R0402  [R0402]
U22  TMUX1104DGSR  [SOP50P490X110-10N]
U27  TMUX1104DGSR  [SOP50P490X110-10N]
U28  TMUX1104DGSR  [SOP50P490X110-10N]
U29  TPS62120  [SOP65P280X145-8N]
U37  TMUX1104DGSR  [SOP50P490X110-10N]

### Nets
DIRSENSE0: U37.2(S1) ; also sheet 3
DIRSENSE1: U37.9(S2) ; also sheet 3
DIRSENSE2: U37.4(S3) ; also sheet 3
DIRSENSE3: U37.7(S4) ; also sheet 3
DIRSENSE_MUX_D: R52.1 U37.8(D) ; also sheet 1
GND: C43.2 C44.2 C45.2 C46.2 C48.2 C63.2 D2.A D3.A D30.A D37.A D38.A JP21.3 JP21.4 R4.1 R65.1 R67.1 R69.1 R71.1 U22.3(GND) U27.3(GND) U28.3(GND) U29.2(GND) U37.3(GND) ; also sheet 1,2,3,4,6
ISENSE0: U27.2(S1) ; also sheet 3
ISENSE1: U27.9(S2) ; also sheet 3
ISENSE2: U27.4(S3) ; also sheet 3
ISENSE3: U27.7(S4) ; also sheet 3
ISENSE_MUX_D: D2.C U27.8(D) ; also sheet 1
N$2: D1.1(A) JP1.1
N$6: C47.2 R3.1 R4.2 U29.5(FB)
N$7: L1.P$1 U29.7(SW)
SENSE_MUX_A0: U22.1(A0) U27.1(A0) U28.1(A0) U37.1(A0) ; also sheet 1
SENSE_MUX_A1: U22.10(A1) U27.10(A1) U28.10(A1) U37.10(A1) ; also sheet 1
SENSE_MUX_EN: U22.5(EN) U27.5(EN) U28.5(EN) U37.5(EN) ; also sheet 1
VCC: C43.1 C44.1 C45.1 C47.1 C48.1 C63.1 L1.P$2 R3.2 R52.2 U22.6(VDD) U27.6(VDD) U28.6(VDD) U29.4(SGND) U29.8(VOUT) U37.6(VDD) ; also sheet 1,2,4,6
VHARVEST0: R6.2 ; also sheet 3
VHARVEST0_SCALED: D3.C R6.1 R65.2 U28.2(S1)
VHARVEST1: R66.2 ; also sheet 3
VHARVEST1_SCALED: D30.C R66.1 R67.2 U28.9(S2)
VHARVEST2: R68.2 ; also sheet 3
VHARVEST2_SCALED: D37.C R68.1 R69.2 U28.4(S3)
VHARVEST3: R70.2 ; also sheet 3
VHARVEST3_SCALED: D38.C R70.1 R71.2 U28.7(S4)
VHARVEST_MUX_D: U28.8(D) ; also sheet 1
VHARVEST_OR: C46.1 D1.3(C) JP21.1 JP21.2 U29.1(VIN) U29.3(EN) ; also sheet 3,4,6
VSENSE0: U22.2(S1) ; also sheet 3
VSENSE1: U22.9(S2) ; also sheet 3
VSENSE2: U22.4(S3) ; also sheet 3
VSENSE3: U22.7(S4) ; also sheet 3
VSENSE_MUX_D: U22.8(D) ; also sheet 1
VUSB: JP1.2 ; also sheet 2
Unconnected: U29.6(PG)

## Sheet 6 of 6
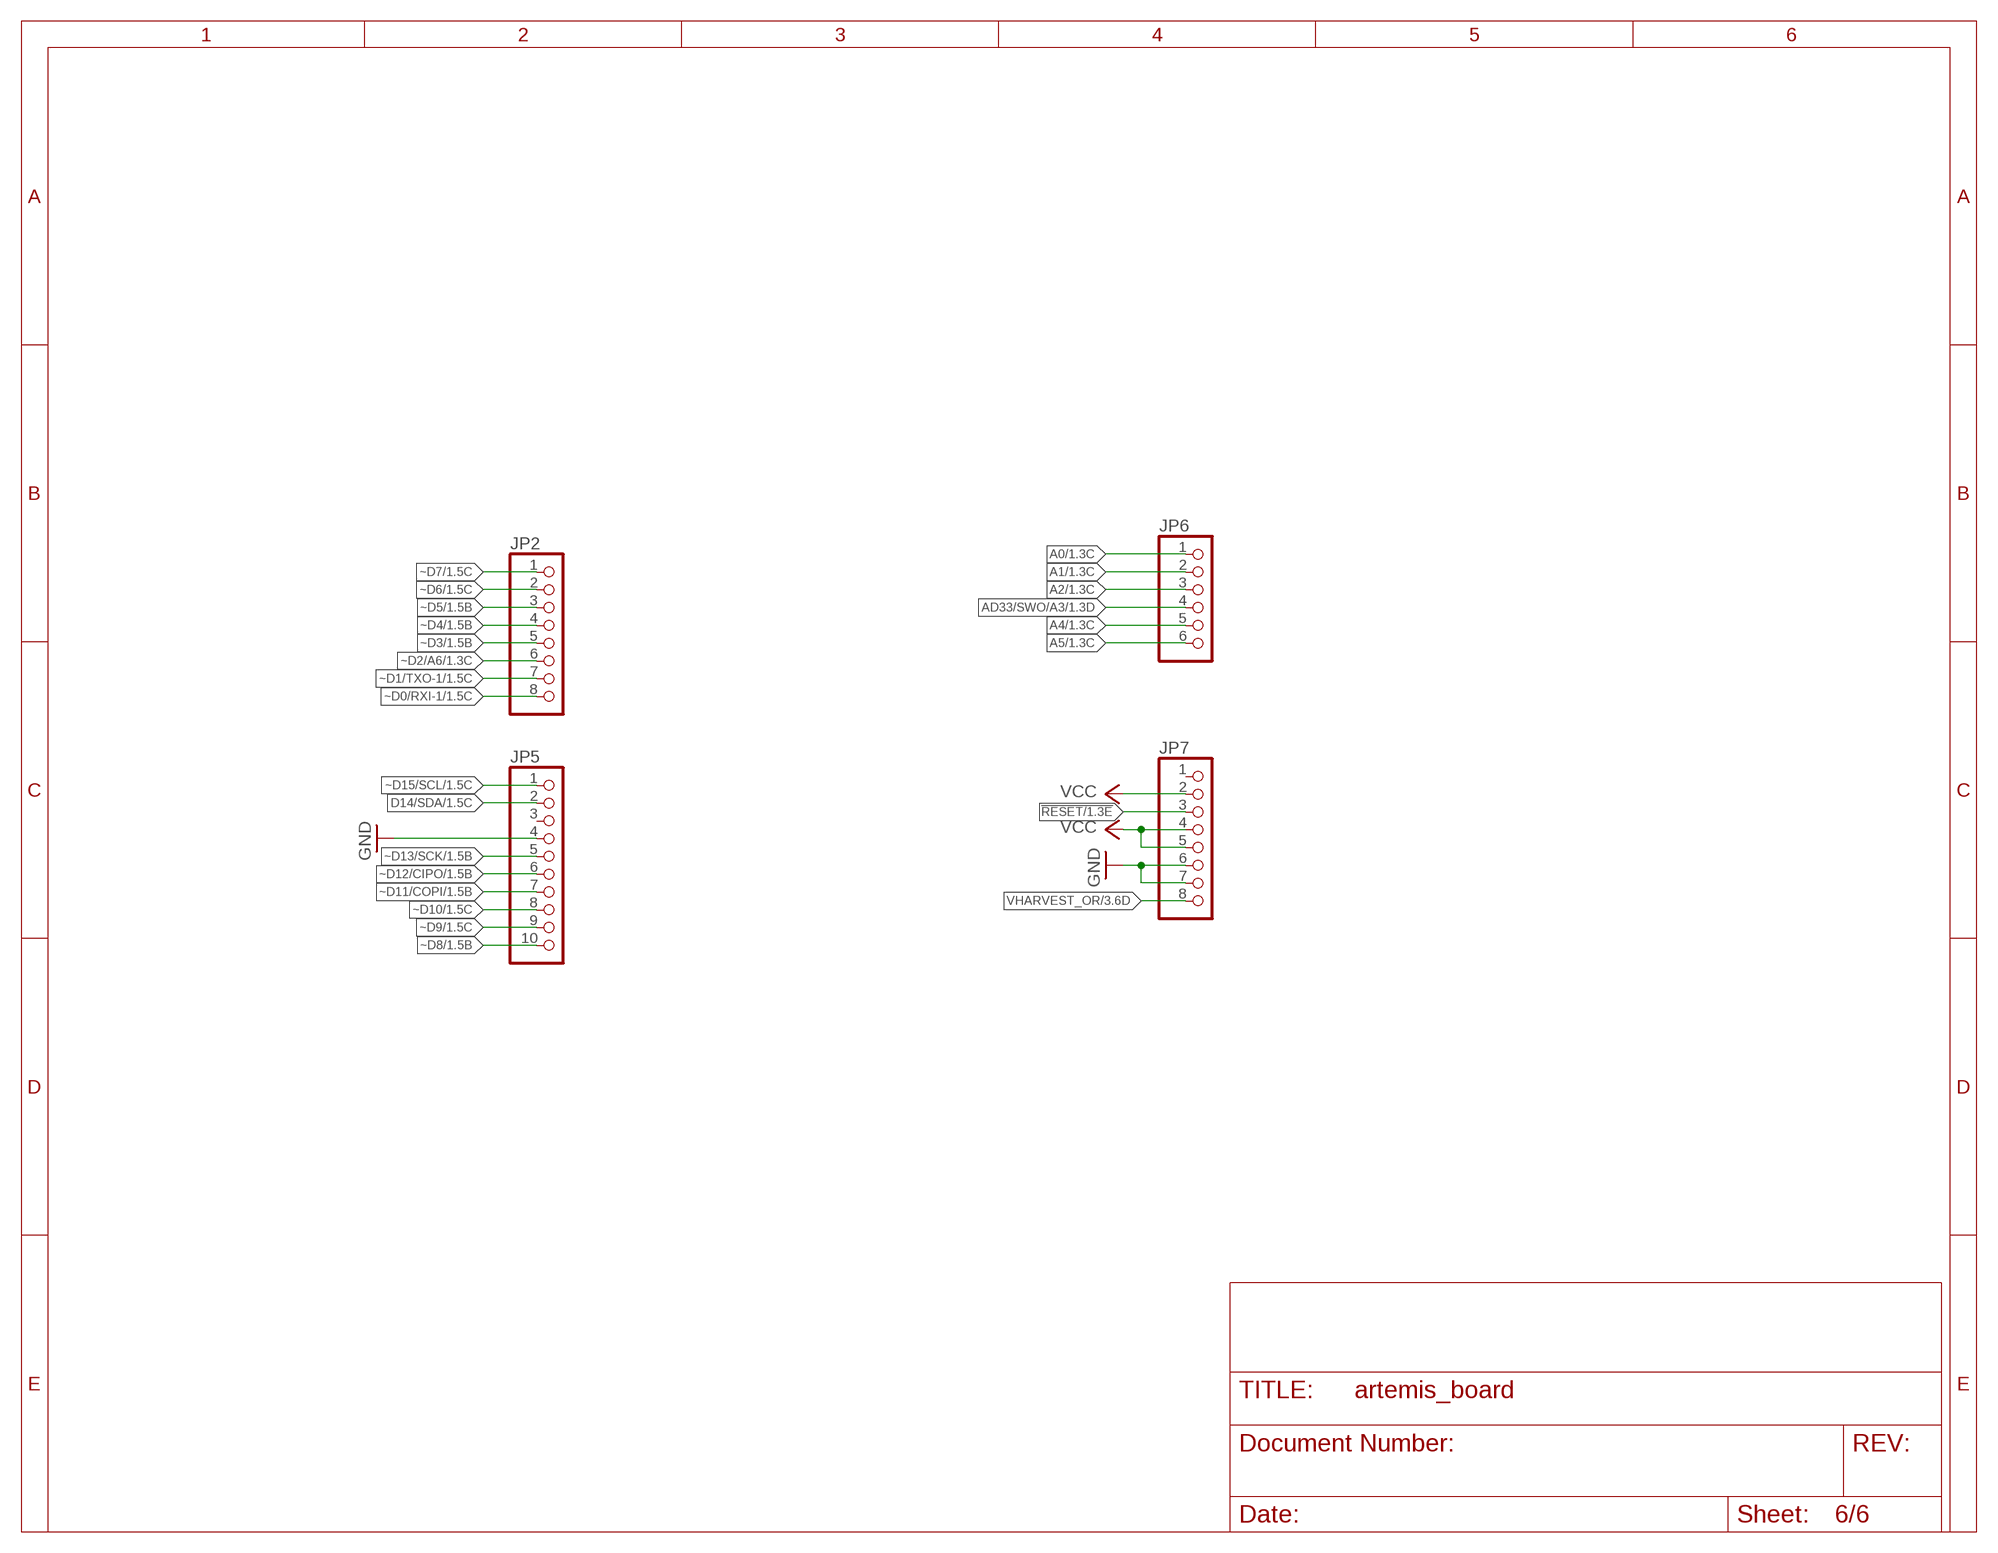
[diagram p5: schematic, sheet 6]

### Parts
JP2  PINHD-1X8  [1X08]
JP5  PINHD-1X10  [1X10]
JP6  PINHD-1X6  [1X06]
JP7  PINHD-1X8  [1X08]

### Nets
!RESET: JP7.3 ; also sheet 1,2
A0: JP6.1 ; also sheet 1
A1: JP6.2 ; also sheet 1
A2: JP6.3 ; also sheet 1
A4: JP6.5 ; also sheet 1
A5: JP6.6 ; also sheet 1
AD33/SWO/A3: JP6.4 ; also sheet 1
D14/SDA: JP5.2 ; also sheet 1
GND: JP5.4 JP7.6 JP7.7 ; also sheet 1,2,3,4,5
VCC: JP7.2 JP7.4 JP7.5 ; also sheet 1,2,4,5
VHARVEST_OR: JP7.8 ; also sheet 3,4,5
~D0/RXI-1: JP2.8 ; also sheet 1
~D1/TXO-1: JP2.7 ; also sheet 1
~D2/A6: JP2.6 ; also sheet 1
~D3: JP2.5 ; also sheet 1
~D4: JP2.4 ; also sheet 1
~D5: JP2.3 ; also sheet 1
~D6: JP2.2 ; also sheet 1
~D7: JP2.1 ; also sheet 1
~D8: JP5.10 ; also sheet 1
~D9: JP5.9 ; also sheet 1
~D10: JP5.8 ; also sheet 1
~D11/COPI: JP5.7 ; also sheet 1
~D12/CIPO: JP5.6 ; also sheet 1
~D13/SCK: JP5.5 ; also sheet 1
~D15/SCL: JP5.1 ; also sheet 1
Unconnected: JP5.3 JP7.1

## Library data of the parts
C1 C2 C4 = rcl:C-US: CAPACITOR, American symbol; MFR: SAMSUNG; MFR_PN: CL05A105KO5NNNC; SPICEPREFIX: C
C3 C5 C40 C50 C51 = rcl:C-US: CAPACITOR, American symbol; MFR: SAMSUNG; MFR_PN: CL05B104KO5NNNC; SPICEPREFIX: C
C6-C9 C28-C33 C41-C45 C53-C63 = rcl:C-US: CAPACITOR, American symbol; MFR: SAMSUNG; MFR_PN: CL05B103KO5NNNC; SPICEPREFIX: C
C10 C11 C16 C17 C22 C23 C34 C35 C52 = rcl:C-US: CAPACITOR, American symbol; MFR: SAMSUNG; MFR_PN: CL05B102KB5NNNC; SPICEPREFIX: C
C12 C14 C18 C20 C24 C26 C36 C38 = rcl:C-US: CAPACITOR, American symbol; MFR: TDK; MFR_PN: C3216X5R1E476M160AC; SPICEPREFIX: C
C13 C19 C25 C37 = rcl:CPOL-US: POLARIZED CAPACITOR, American symbol; SPICEPREFIX: C
C15 C21 C27 C39 = rcl:C-US: CAPACITOR, American symbol; MFR: SAMSUNG; MFR_PN: CL05B103KB5NNNC; SPICEPREFIX: C
C46 C48 = rcl:C-US: CAPACITOR, American symbol; MFR: SAMSUNG; MFR_PN: CL10A475KA8NQNC; SPICEPREFIX: C
C47 = rcl:C-US: CAPACITOR, American symbol; MFR: KEMET; MFR_PN: C0603C220J5GACTU; SPICEPREFIX: C
C49 = rcl:C-US: CAPACITOR, American symbol; MFR: SAMSUNG; MFR_PN: CL10A106MQ8NNNC; SPICEPREFIX: C
D1 D6 D10 D14 D22 = diode:BAT54: Schottky Diodes Source: Fairchild .. BAT54.pdf; MFR: ON; MFR_PN: BAT54
D2 D3 D30 D37 D38 = SparkFun-DiscreteSemi:DIODE-ZENER: Zener Diode A Zener diode allows current to flow from its anode to its cathode like a normal semiconductor diode, but it also permits current to flow in the reverse direction when its "Zener voltage" is reached. - WIkipedia; MFR: DIODES_INCORPORATED; MFR_PN: BZT52C2V0S-7-F; PROD_ID: DIO-11284
D4 D5 D18-D21 D26-D29 D31-D36 = afig-0007:DFLU1200; MFR: diodes incorporated; MFR_PN: DFLU1200-7
D7 D9 D11 D13 D15 D17 D23 D25 = SparkFun-DiscreteSemi:DIODE-ZENER: Zener Diode A Zener diode allows current to flow from its anode to its cathode like a normal semiconductor diode, but it also permits current to flow in the reverse direction when its "Zener voltage" is reached. - WIkipedia; MFR: DIODES_INCORPORATED; MFR_PN: BZT52C15S; PROD_ID: DIO-11284
D8 D12 D16 D24 = SparkFun-DiscreteSemi:DIODE-ZENER: Zener Diode A Zener diode allows current to flow from its anode to its cathode like a normal semiconductor diode, but it also permits current to flow in the reverse direction when its "Zener voltage" is reached. - WIkipedia; MFR: diodes incorporated; MFR_PN: BZT52C15S; PROD_ID: DIO-11284
J1 = micro_usb:10118192-0001LF: CONN USB MICRO B RECPT SMT R/A; DIGIKEY: 609-4613-1-ND; MFR: Amphenol ICC (FCI); MFR_PN: 10118192-0001LF
J2 = FTSH-105-01-F-DV-007-K-P:FTSH-105-01-F-DV-007-K-P: 10-pin, keyed, 1.27mm header for cortex SWD connections. Missing pin 7 is "key pin" space 1 -- VCC SWDIO/TMS -- 2 3 -- GND SWDCLK/TCK -- 4 5 -- GND SWO/TDO -- 6 7 -- KEY NC/TDI -- 8 9 -- GNDDETECT nRESET -- 10; MFR: samtec; MFR_PN: FTSH-105-01-F-DV-007-K-P
JP1 = pinhead:PINHD-1X2: PIN HEADER
JP2 JP7 = pinhead:PINHD-1X8: PIN HEADER
JP3 JP4 JP8-JP14 JP18-JP20 = jst-sh:JST-SH-2; MFR: jst; MFR_PN: SM02B-SRSS-TB(LF)(SN)
JP5 = pinhead:PINHD-1X10: PIN HEADER
JP6 = pinhead:PINHD-1X6: PIN HEADER
JP15-JP17 = DC_LOAD_AU:PINHD-1X2: PIN HEADER
JP21 = pinhead:PINHD-1X4: PIN HEADER
L1 = afig-0007:LQH3NPN220MMEL; MFR: MURATA; MFR_PN: LQH3NPN220MJRL
LED1-LED4 = led:LED: LED OSRAM: - CHIPLED LG R971, LG N971, LY N971, LG Q971, LY Q971, LO R971, LY R971 LH N974, LH R974 LS Q976, LO Q976, LY Q976 LO Q996 - Hyper CHIPLED LW Q18S LB Q993, LB Q99A, LB R99A - SideLED LS A670, LO A670, LY A670, LG A670, LP A670 LB A673, LV A673, LT A673, LW A673 LH A674 LY A675 LS A676, LA A676, LO A676, LY A676, LW A676 LS A679, LY A679, LG A679 - Hyper Micro SIDELED® LS Y876, LA Y876, LO Y876, LY Y876 LT Y87S - SmartLED LW L88C, LW L88S LB L89C, LB L89S, LG L890 LS L89K, LO L89K, LY L89K LS L896, LA L896, LO L896, LY L896 - TOPLED LS T670, LO T670, LY T670, LG T670, LP T670 LSG T670, LSP T670, LSY T670, LOP T670, LYG T670 LG T671, LOG T671, LSG T671 LB T673, LV T673, LT T673, LW T673 LH T674 LS T676, LA T676, LO T676, LY T676, LB T676, LH T676, LSB T676, LW T676 LB T67C, LV T67C, LT T67C, LS T67K, LO T67K, LY T67K, LW E67C LS E67B, LA E67B, LO E67B, LY E67B, LB E67C, LV E67C, LT E67C LW T67C LS T679, LY T679, LG T679 LS T770, LO T770, LY T770, LG T770, LP T770 LB T773, LV T773, LT T773, LW T773 LH T774 LS E675, LA E675, LY E675, LS T675 LS T776, LA T776, LO T776, LY T776, LB T776 LHGB T686 LT T68C, LB T68C - Hyper Mini TOPLED® LB M676 - Mini TOPLED Santana® LG M470 LS M47K, LO M47K, LY M47K Source: http://www.osram.convergy.de LUXEON: - LUMILED® LXK2-PW12-R00, LXK2-PW12-S00, LXK2-PW14-U00, LXK2-PW14-V00 LXK2-PM12-R00, LXK2-PM12-S00, LXK2-PM14-U00 LXK2-PE12-Q00, LXK2-PE12-R00, LXK2-PE12-S00, LXK2-PE14-T00, LXK2-PE14-U00 LXK2-PB12-K00, LXK2-PB12-L00, LXK2-PB12-M00, LXK2-PB14-N00, LXK2-PB14-P00, LXK2-PB14-Q00 LXK2-PR12-L00, LXK2-PR12-M00, LXK2-PR14-Q00, LXK2-PR14-R00 LXK2-PD12-Q00, LXK2-PD12-R00, LXK2-PD12-S00 LXK2-PH12-R00, LXK2-PH12-S00 LXK2-PL12-P00, LXK2-PL12-Q00, LXK2-PL12-R00 Source: www.luxeon.com KINGBRIGHT: KA-3528ASYC Source: www.kingbright.com; MFR: stanley electric co; MFR_PN: BR1111C-TR
Q5 Q7 Q9 Q11 Q13 Q15 Q17 Q19 Q21 Q23 Q25 Q27 Q29 Q31 Q33 Q35 = afig-0007:2N7002K-7; MFR: diodes incorporated; MFR_PN: 2N7002K-7
Q6 Q8 Q10 Q12 Q14 Q16 Q18 Q20 Q22 Q24 Q26 Q28 Q30 Q32 Q34 Q36 = afig-0007:BSS138K; MFR: on semiconductor; MFR_PN: BSS138K
R1 = rcl:R-US_: RESISTOR, American symbol; MFR: yageo; MFR_PN: RC0402FR-07220KL; SPICEPREFIX: R
R2 R25 R27 R29 R37 R39 R41 R43 R45 R47 R50-R53 R55 R57 R59 R61 R63 = rcl:R-US_: RESISTOR, American symbol; MFR: yageo; MFR_PN: RC0402FR-071ML; SPICEPREFIX: R
R3 = rcl:R-US_: RESISTOR, American symbol; MFR: PANASONIC; MFR_PN: ERJ-3GEYJ364V; SPICEPREFIX: R
R4 = rcl:R-US_: RESISTOR, American symbol; MFR: PANASONIC; MFR_PN: ERJ-3GEYJ244V; SPICEPREFIX: R
R5 R26 R28 R30 R38 R40 R42 R44 R46 R48 R49 R54 R56 R58 R60 R62 R64 = rcl:R-US_: RESISTOR, American symbol; MFR: yageo; MFR_PN: RC0402FR-07100KL; SPICEPREFIX: R
R6 R66 R68 R70 = rcl:R-US_: RESISTOR, American symbol; MFR: PANASONIC; MFR_PN: ERJ-2RKF1803X; SPICEPREFIX: R
R7 R13 R19 R31 = rcl:R-US_: RESISTOR, American symbol; MFR: YAGEO; MFR_PN: RC0402FR-071ML; SPICEPREFIX: R
R8 R10 R12 R14 R16 R18 R20 R22 R24 R32 R34 R36 = rcl:R-US_: RESISTOR, American symbol; MFR: YAGEO; MFR_PN: RC0402FR-07150KL; SPICEPREFIX: R
R9 R15 R21 R33 = rcl:R-US_: RESISTOR, American symbol; MFR: PANASONIC; MFR_PN: ERJ-3BQF3R3V; SPICEPREFIX: R
R11 R17 R23 R35 = rcl:R-US_: RESISTOR, American symbol; MFR: YAGEO; MFR_PN: RC0402FR-0710KL; SPICEPREFIX: R
R65 R67 R69 R71 = rcl:R-US_: RESISTOR, American symbol; MFR: PANASONIC; MFR_PN: ERJ-2RKF2002X; SPICEPREFIX: R
R72-R75 = rcl:R-US_: RESISTOR, American symbol; MFR: yageo; MFR_PN: RC0402FR-07330RL; SPICEPREFIX: R
SW1-SW3 = fsm4jsma:TE_FSM4JSMA: Tactile Switch OFF-MOM, Surface Mount. This is from the standard FSMJSMA switch line by TE connectivity.; MFR: TE connectivity; MFR_PN: FSM4JSMA
TVS1 = RCLAMP3654PATCT:RCLAMP3654PAT; DIGIKEY: RCLAMP3654PATCTCT-ND; MFR: SEMTECH; MFR_PN: RCLAMP3654PATCT
U1 = SparkFun-IC-Microcontroller:ARTEMIS_MODULE: Description: The Artemis Module from SparkFun is a Cortex-M4F with BLE 5.0 running up to 96MHz and with as low power as 6uA per MHz (less than 5mW). This is the world's first module to bridge the market between hobbyists and consumer products. We've packaged all the power of a modern microcontroller into a module that is both extremely easy to use but is mass-market ready. The flexibility of the Artemis module starts with our [Arduino core](https://github.com/sparkfun/Arduino_Apollo3). You can program and use the Artemis module just like you would an Uno or any other Arduino. Time to first blink is just 5 minutes away! We built the core from the ground up, making it fast and as light weight as possible.; MFR: sparkfun; MFR_PN: WRL-15484; PROD_ID: SUB-14402
U2 = silabs:CP210*: Single-Chip USB to UART Bridge Source: www.silabs.com .. CP2101.pdf / cp2102.pdf; MF: FARNELL; MFR_PN: CP2102-GM; MPN: CP2102-GM; OC_FARNELL: 9282130; OC_NEWARK: 30K5635
U3 U21 = 74AXP1T45:74AXP1T45GWH; DIGIKEY: 1727-74AXP1T45GWHCT-ND; MFR: NEXPERIA; MFR_PN: 74AXP1T45GWH
U4 U5 U14 U19 U20 U31-U33 = afig-0007:CDBHD140L-G; MFR: comchip; MFR_PN: CDBHD140L-G
U6 U7 U10 U11 U15 U16 U23 U24 = afig-0007:CDBHD140L-G; MFR: COMCHIP; MFR_PN: CDBHD140L-G
U8 U12 U17 U25 = max9938:MAX9938: 1μA, 4-Bump UCSP/SOT23, Precision Current-Sense Amplifier The MAX9938 high-side current-sense amplifier offers precision accuracy specifications of VOS less than 500μV (max) and gain error less than 0.5% (max). Quiescent supply current is an ultra-low 1μA. The MAX9938 fits in a tiny, 1mm x 1mm UCSPTM package size or a 5-pin SOT23 package, making the part ideal for applications in notebook computers, cell phones, PDAs, and all battery-operated portable devices where accura- cy, low quiescent current, and small size are critical. The MAX9938 features an input common-mode voltage range from 1.6V to 28V. These current-sense amplifiers have a voltage output and are offered in four gain versions: 25V/V (MAX9938T), 50V/V (MAX9938F), 100V/V (MAX9938H), and 200V/V (MAX9938W). The four gain selections offer flexibility in the choice of the external current-sense resistor. The very low 500μV (max) input offset voltage allows small 25mV to 50mV full-scale VSENSE voltage for very low voltage drop at full-current measurement. The MAX9938 is offered in tiny 4-bump, UCSP (1mm x 1mm x 0.6mm footprint), 5-pin SOT23, and 6-pin μDFN (2mm x 2mm x 0.8mm) packages specified for operation over the -40°C to +85°C extended temperature range.; MFR: MAXIM; MFR_PN: MAX9938TEUK+T
U9 U13 U18 U26 = tn2106:TN2106K1-G: N-Channel Enhancement-Mode Vertical DMOS FET R_dson(max) = 2.5Ohm V_gs(th)(max) = 2V; MFR: MICROCHIP; MFR_PN: TN2106K1-G
U22 U27 U28 U37 = tmux1104:TMUX1104DGSR; DIGIKEY: 296-53437-1-ND; MFR: texas instruments; MFR_PN: MUX1104DGSR
U29 = afig-0007:TPS62120; MFR: TI; MFR_PN: TPS62120
U30 U34-U36 = tmux1108:TMUX1108RSVR; DIGIKEY: 296-53257-1-ND; MFR: TI; MFR_PN: TMUX1108RSVR